# Altium project alpha-board.PrjPCB
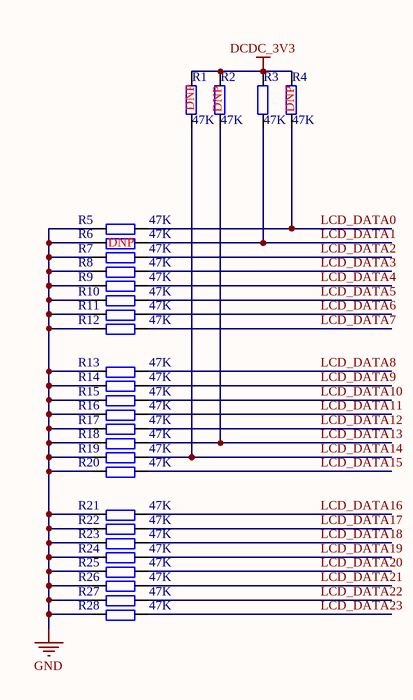
[diagram p0: Sheet1.SchDoc]
8 sheets, 239 parts. Net scope: global (net labels, ports and power ports of the same name join across sheets).
Board file: PCB1.PcbDoc
Sheets:
  Sheet1.SchDoc
  Sheet2.SchDoc
  Sheet3.SchDoc
  Sheet4.SchDoc
  Sheet5.SchDoc
  Sheet6.SchDoc
  Sheet7.SchDoc
  Sheet8.SchDoc

## Sheet Sheet1.SchDoc
size A4

### Parts
R1  47K  [R 0402]
R2  47K  [R 0402]
R3  47K  [R 0402]
R4  47K  [R 0402]
R5  47K  [R 0402]
R6  47K  [R 0402]
R7  47K  [R 0402]
R8  47K  [R 0402]
R9  47K  [R 0402]
R10  47K  [R 0402]
R11  47K  [R 0402]
R12  47K  [R 0402]
R13  47K  [R 0402]
R14  47K  [R 0402]
R15  47K  [R 0402]
R16  47K  [R 0402]
R17  47K  [R 0402]
R18  47K  [R 0402]
R19  47K  [R 0402]
R20  47K  [R 0402]
R21  47K  [R 0402]
R22  47K  [R 0402]
R23  47K  [R 0402]
R24  47K  [R 0402]
R25  47K  [R 0402]
R26  47K  [R 0402]
R27  47K  [R 0402]
R28  47K  [R 0402]

### Nets
DCDC_3V3: R1.1 R2.1 R3.1 R4.1  [project net NVCC_3V3]
GND: R5.1 R6.1 R7.1 R8.1 R9.1 R10.1 R11.1 R12.1 R13.1 R14.1 R15.1 R16.1 R17.1 R18.1 R19.1 R20.1 R21.1 R22.1 R23.1 R24.1 R25.1 R26.1 R27.1 R28.1
LCD_DATA0: R4.2 R5.2
LCD_DATA1: R3.2 R6.2
LCD_DATA2: R7.2
LCD_DATA3: R8.2
LCD_DATA4: R9.2
LCD_DATA5: R10.2
LCD_DATA6: R11.2
LCD_DATA7: R12.2
LCD_DATA8: R13.2
LCD_DATA9: R14.2
LCD_DATA10: R15.2
LCD_DATA11: R16.2
LCD_DATA12: R17.2
LCD_DATA13: R2.2 R18.2
LCD_DATA14: R1.2 R19.2
LCD_DATA15: R20.2
LCD_DATA16: R21.2
LCD_DATA17: R22.2
LCD_DATA18: R23.2
LCD_DATA19: R24.2
LCD_DATA20: R25.2
LCD_DATA21: R26.2
LCD_DATA22: R27.2
LCD_DATA23: R28.2

### Notes on the sheet
- (near R1) DNP
- (near R2) DNP
- (near R4) DNP
- (near R6) DNP

### Library data of the parts
R1-R28 = R

## Sheet Sheet2.SchDoc
size A4
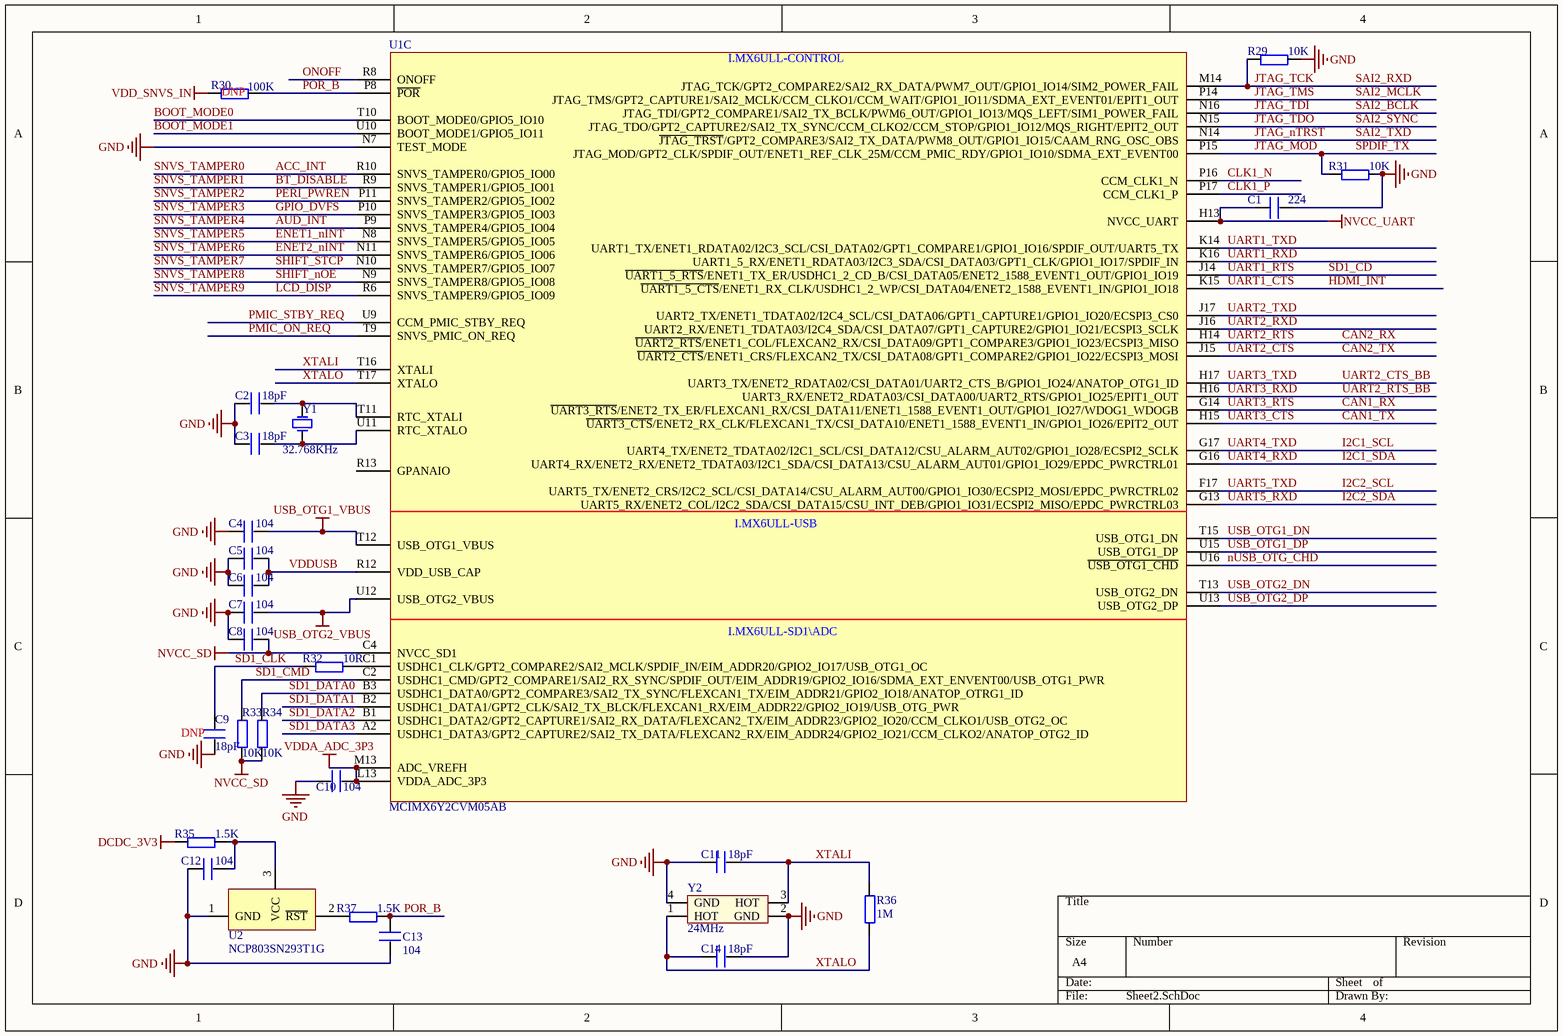
[diagram p1: Sheet2.SchDoc]

### Parts
C1  224  [C 0402]
C2  18pF  [C 0402]
C3  18pF  [C 0402]
C4  104  [C 0402]
C5  104  [C 0402]
C6  104  [C 0402]
C7  104  [C 0402]
C8  104  [C 0402]
C9  18pF  [C 0402]
C10  104  [C 0402]
C11  18pF  [C 0402]
C12  104  [C 0402]
C13  104  [C 0402]
C14  18pF  [C 0402]
R29  10K  [R 0402]
R30  100K  [R 0402]
R31  10K  [R 0402]
R32  10R  [R 0402]
R33  10K  [R 0402]
R34  10K  [R 0402]
R35  1.5K  [R 0402]
R36  1M  [R 0402]
R37  1.5K  [R 0402]
U1  MCIMX6Y2CVM05AB  [BGA289C80P17X17_1400X1400X132]  (part C of 5)
U2  NCP803SN293T1G  [SOT23-3L]
Y1  32.768KHz  [XTAL-3215]
Y2  24MHz  [XTAL-3225]

### Nets
DCDC_3V3: C1.1 C10.2 R35.1 U1.H13(NVCC_UART) U1.L13(VDDA_ADC_3P3) U1.M13(ADC_VREFH)  [also labelled NVCC_UART, VDDA_ADC_3P3]  [project net NVCC_3V3]
GND: C1.2 C2.1 C3.1 C4.1 C5.1 C6.1 C7.1 C8.1 C9.2 C10.1 C11.1 C12.2 C13.1 C14.2 R29.2 R31.2 U1.N7(TEST_MODE) U2.1(GND) Y2.2(GND) Y2.4(GND)
NVCC_SD: C8.2 R33.1 R34.1 U1.C4(NVCC_SD1)
USB_OTG1_VBUS: C4.2 U1.T12(USB_OTG1_VBUS)
USB_OTG2_VBUS: C7.2 U1.U12(USB_OTG2_VBUS)
VDD_SNVS_IN: R30.1
ACC_INT: U1.R10(SNVS_TAMPER0/GPIO5_IO00)  [also labelled SNVS_TAMPER0]
AUD_INT: U1.P9(SNVS_TAMPER4/GPIO5_IO04)  [also labelled SNVS_TAMPER4]
BOOT_MODE0: U1.T10(BOOT_MODE0/GPIO5_IO10)
BOOT_MODE1: U1.U10(BOOT_MODE1/GPIO5_IO11)
BT_DISABLE: U1.R9(SNVS_TAMPER1/GPIO5_IO01)  [also labelled SNVS_TAMPER1]  [project net BEEP]
CAN1_RX: U1.G14(~{UART3_RTS}/ENET2_TX_ER/FLEXCAN1_RX/CSI_DATA11/ENET1_1588_EVENT1_OUT/GPIO1_IO27/WDOG1_WDOGB)  [also labelled UART3_RTS]
CAN1_TX: U1.H15(~{UART3_CTS}/ENET2_RX_CLK/FLEXCAN1_TX/CSI_DATA10/ENET1_1588_EVENT1_IN/GPIO1_IO26/EPIT2_OUT)  [also labelled UART3_CTS]
CAN2_RX: U1.H14(~{UART2_RTS}/ENET1_COL/FLEXCAN2_RX/CSI_DATA09/GPT1_COMPARE3/GPIO1_IO23/ECSPI3_MISO)  [also labelled UART2_RTS]
CAN2_TX: U1.J15(~{UART2_CTS}/ENET1_CRS/FLEXCAN2_TX/CSI_DATA08/GPT1_COMPARE2/GPIO1_IO22/ECSPI3_MOSI)  [also labelled UART2_CTS]
CLK1_N: U1.P16(CCM_CLK1_N)
CLK1_P: U1.P17(CCM_CLK1_P)
ENET1_nINT: U1.N8(SNVS_TAMPER5/GPIO5_IO05)  [also labelled SNVS_TAMPER5]  [project net ENET1_INT_TREE#]
ENET2_nINT: U1.N11(SNVS_TAMPER6/GPIO5_IO06)  [also labelled SNVS_TAMPER6]  [project net ENET2_INT_TREE#]
GPIO_DVFS: U1.P10(SNVS_TAMPER3/GPIO5_IO03)  [also labelled SNVS_TAMPER3]
HDMI_INT: U1.K15(~{UART1_5_CTS}/ENET1_RX_CLK/USDHC1_2_WP/CSI_DATA04/ENET2_1588_EVENT1_IN/GPIO1_IO18)  [also labelled UART1_CTS]
I2C1_SCL: U1.G17(UART4_TX/ENET2_TDATA02/I2C1_SCL/CSI_DATA12/CSU_ALARM_AUT02/GPIO1_IO28/ECSPI2_SCLK)  [also labelled UART4_TXD]
I2C1_SDA: U1.G16(UART4_RX/ENET2_RX/ENET2_TDATA03/I2C1_SDA/CSI_DATA13/CSU_ALARM_AUT01/GPIO1_IO29/EPDC_PWRCTRL01)  [also labelled UART4_RXD]
I2C2_SCL: U1.F17(UART5_TX/ENET2_CRS/I2C2_SCL/CSI_DATA14/CSU_ALARM_AUT00/GPIO1_IO30/ECSPI2_MOSI/EPDC_PWRCTRL02)  [also labelled UART5_TXD]
I2C2_SDA: U1.G13(UART5_RX/ENET2_COL/I2C2_SDA/CSI_DATA15/CSU_INT_DEB/GPIO1_IO31/ECSPI2_MISO/EPDC_PWRCTRL03)  [also labelled UART5_RXD]
JTAG_MOD: R31.1 U1.P15(JTAG_MOD/GPT2_CLK/SPDIF_OUT/ENET1_REF_CLK_25M/CCM_PMIC_RDY/GPIO1_IO10/SDMA_EXT_EVENT00)  [also labelled SPDIF_TX]  [project net 6D_INT]
JTAG_nTRST: U1.N14(~{JTAG_TRST}/GPT2_COMPARE3/SAI2_TX_DATA/PWM8_OUT/GPIO1_IO15/CAAM_RNG_OSC_OBS)  [also labelled SAI2_TXD]
JTAG_TCK: R29.1 U1.M14(JTAG_TCK/GPT2_COMPARE2/SAI2_RX_DATA/PWM7_OUT/GPIO1_IO14/SIM2_POWER_FAIL)  [also labelled SAI2_RXD]
JTAG_TDI: U1.N16(JTAG_TDI/GPT2_COMPARE1/SAI2_TX_BCLK/PWM6_OUT/GPIO1_IO13/MQS_LEFT/SIM1_POWER_FAIL)  [also labelled SAI2_BCLK]
JTAG_TDO: U1.N15(JTAG_TDO/GPT2_CAPTURE2/SAI2_TX_SYNC/CCM_CLKO2/CCM_STOP/GPIO1_IO12/MQS_RIGHT/EPIT2_OUT)  [also labelled SAI2_SYNC]
JTAG_TMS: U1.P14(JTAG_TMS/GPT2_CAPTURE1/SAI2_MCLK/CCM_CLKO1/CCM_WAIT/GPIO1_IO11/SDMA_EXT_EVENT01/EPIT1_OUT)  [also labelled SAI2_MCLK]
LCD_DISP: U1.R6(SNVS_TAMPER9/GPIO5_IO09)  [also labelled SNVS_TAMPER9]  [project net CT_RST]
nUSB_OTG_CHD: U1.U16(~{USB_OTG1_CHD})
ONOFF: U1.R8(ONOFF)
PERI_PWREN: U1.P11(SNVS_TAMPER2/GPIO5_IO02)  [also labelled SNVS_TAMPER2]
PMIC_ON_REQ: U1.T9(SNVS_PMIC_ON_REQ)
PMIC_STBY_REQ: U1.U9(CCM_PMIC_STBY_REQ)
POR_B: C13.2 R30.2 R37.2 U1.P8(~{POR})
SD1_CD: U1.J14(~{UART1_5_}~{RTS}/ENET1_TX_ER/USDHC1_2_CD_B/CSI_DATA05/ENET2_1588_EVENT1_OUT/GPIO1_IO19)  [also labelled UART1_RTS]
SD1_CLK: C9.1 R32.1
SD1_CMD: R33.2 U1.C2(USDHC1_CMD/GPT2_COMPARE1/SAI2_RX_SYNC/SPDIF_OUT/EIM_ADDR19/GPIO2_IO16/SDMA_EXT_ENVENT00/USB_OTG1_PWR)
SD1_DATA0: R34.2 U1.B3(USDHC1_DATA0/GPT2_COMPARE3/SAI2_TX_SYNC/FLEXCAN1_TX/EIM_ADDR21/GPIO2_IO18/ANATOP_OTRG1_ID)
SD1_DATA1: U1.B2(USDHC1_DATA1/GPT2_CLK/SAI2_TX_BLCK/FLEXCAN1_RX/EIM_ADDR22/GPIO2_IO19/USB_OTG_PWR)
SD1_DATA2: U1.B1(USDHC1_DATA2/GPT2_CAPTURE1/SAI2_RX_DATA/FLEXCAN2_TX/EIM_ADDR23/GPIO2_IO20/CCM_CLKO1/USB_OTG2_OC)
SD1_DATA3: U1.A2(USDHC1_DATA3/GPT2_CAPTURE2/SAI2_TX_DATA/FLEXCAN2_RX/EIM_ADDR24/GPIO2_IO21/CCM_CLKO2/ANATOP_OTG2_ID)
SHIFT_nOE: U1.N9(SNVS_TAMPER8/GPIO5_IO08)  [also labelled SNVS_TAMPER8]  [project net ENET2_RST]
SHIFT_STCP: U1.N10(SNVS_TAMPER7/GPIO5_IO07)  [also labelled SNVS_TAMPER7]  [project net ENET1_RST]
UART1_RXD: U1.K16(UART1_5_RX/ENET1_RDATA03/I2C3_SDA/CSI_DATA03/GPT1_CLK/GPIO1_IO17/SPDIF_IN)
UART1_TXD: U1.K14(UART1_TX/ENET1_RDATA02/I2C3_SCL/CSI_DATA02/GPT1_COMPARE1/GPIO1_IO16/SPDIF_OUT/UART5_TX)
UART2_CTS_BB: U1.H17(UART3_TX/ENET2_RDATA02/CSI_DATA01/UART2_CTS_B/GPIO1_IO24/ANATOP_OTG1_ID)  [also labelled UART3_TXD]
UART2_RTS_BB: U1.H16(UART3_RX/ENET2_RDATA03/CSI_DATA00/UART2_RTS/GPIO1_IO25/EPIT1_OUT)  [also labelled UART3_RXD]
UART2_RXD: U1.J16(UART2_RX/ENET1_TDATA03/I2C4_SDA/CSI_DATA07/GPT1_CAPTURE2/GPIO1_IO21/ECSPI3_SCLK)  [project net ECSPI3_SCLK]
UART2_TXD: U1.J17(UART2_TX/ENET1_TDATA02/I2C4_SCL/CSI_DATA06/GPT1_CAPTURE1/GPIO1_IO20/ECSPI3_CS0)  [project net ECSPI3_SS0]
USB_OTG1_DN: U1.T15(USB_OTG1_DN)
USB_OTG1_DP: U1.U15(USB_OTG1_DP)
USB_OTG2_DN: U1.T13(USB_OTG2_DN)
USB_OTG2_DP: U1.U13(USB_OTG2_DP)
VDDUSB: C5.2 C6.2 U1.R12(VDD_USB_CAP)
XTALI: C11.2 R36.2 U1.T16(XTALI) Y2.3(HOT)
XTALO: C14.1 R36.1 U1.T17(XTALO) Y2.1(HOT)
NetC2_2: C2.2 U1.T11(RTC_XTALI) Y1.2(OSC2)
NetC3_2: C3.2 U1.U11(RTC_XTALO) Y1.1(OSC1)
NetC12_1: C12.1 R35.2 U2.3(VCC)
NetR32_2: R32.2 U1.C1(USDHC1_CLK/GPT2_COMPARE2/SAI2_MCLK/SPDIF_IN/EIM_ADDR20/GPIO2_IO17/USB_OTG1_OC)
NetR37_1: R37.1 U2.2(~{RST})

Not connected (* = marked no-connect by the designer): U1 R13(GPANAIO)

### Notes on the sheet
- (near R30) DNP
- (near C9) DNP
- (in symbol MCIMX6Y2CVM05AB, part C) I.MX6ULL-CONTROL; I.MX6ULL-USB; I.MX6ULL-SD1\ADC

### Library data of the parts
C1-C14 = C
R29-R37 = R
Y1 = XTAL: 普通晶振; Published: 8-Jun-2000; LatestRevisionDate: 17-Jul-2002; LatestRevisionNote: Re-released for DXP Platform.; Publisher: Altium Limited
Y2 = XTAL_3225: 3225贴片无源晶振

## Sheet Sheet3.SchDoc
size A4
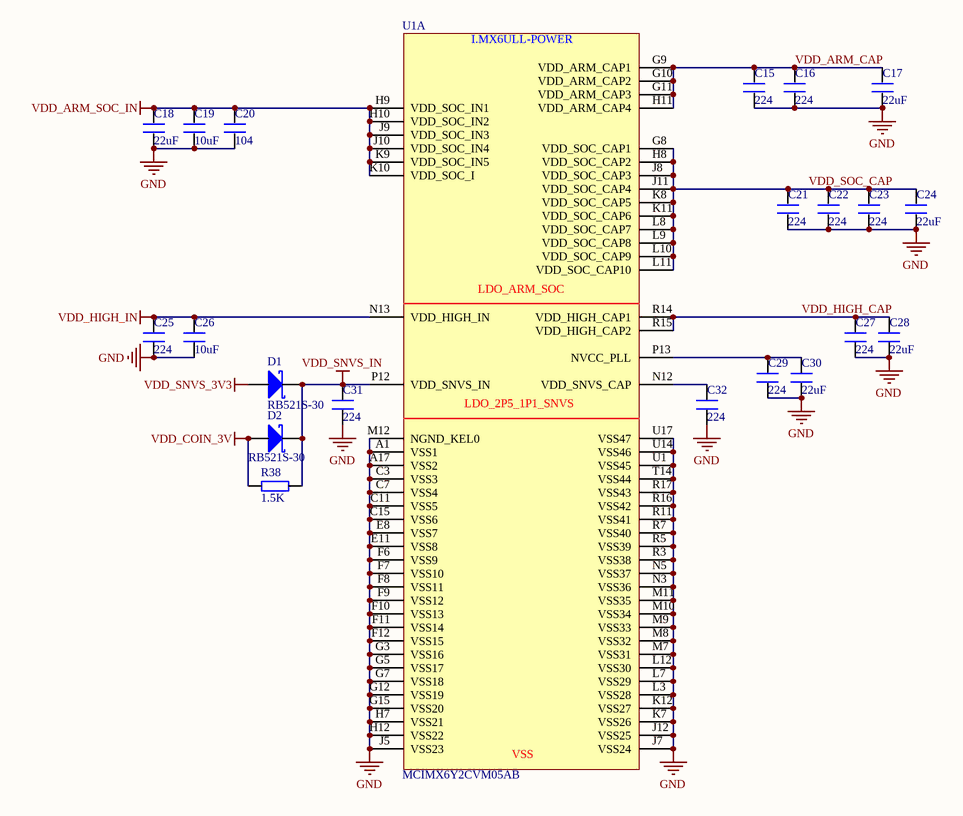
[diagram p2: Sheet3.SchDoc]

### Parts
C15  224  [C 0402]
C16  224  [C 0402]
C17  22uF  [C 0402]
C18  22uF  [C 0402]
C19  10uF  [C 0402]
C20  104  [C 0402]
C21  224  [C 0402]
C22  224  [C 0402]
C23  224  [C 0402]
C24  22uF  [C 0402]
C25  224  [C 0402]
C26  10uF  [C 0402]
C27  224  [C 0402]
C28  22uF  [C 0402]
C29  224  [C 0402]
C30  22uF  [C 0402]
C31  224  [C 0402]
C32  224  [C 0402]
D1  RB521S-30  [SOD-523]
D2  RB521S-30  [SOD-523]
R38  1.5K  [R 0402]
U1  MCIMX6Y2CVM05AB  [BGA289C80P17X17_1400X1400X132]  (part A of 5)

### Nets
GND: C15.1 C16.1 C17.1 C18.1 C19.1 C20.1 C21.1 C22.1 C23.1 C24.1 C25.1 C26.1 C27.1 C28.1 C29.1 C30.1 C31.1 C32.1 U1.A1(VSS1) U1.A17(VSS2) U1.C3(VSS3) U1.C7(VSS4) U1.C11(VSS5) U1.C15(VSS6) U1.E8(VSS7) U1.E11(VSS8) U1.F6(VSS9) U1.F7(VSS10) U1.F8(VSS11) U1.F9(VSS12) U1.F10(VSS13) U1.F11(VSS14) U1.F12(VSS15) U1.G3(VSS16) U1.G5(VSS17) U1.G7(VSS18) U1.G12(VSS19) U1.G15(VSS20) U1.H7(VSS21) U1.H12(VSS22) U1.J5(VSS23) U1.J7(VSS24) U1.J12(VSS25) U1.K7(VSS26) U1.K12(VSS27) U1.L3(VSS28) U1.L7(VSS29) U1.L12(VSS30) U1.M7(VSS31) U1.M8(VSS32) U1.M9(VSS33) U1.M10(VSS34) U1.M11(VSS35) U1.M12(NGND_KEL0) U1.N3(VSS36) U1.N5(VSS37) U1.R3(VSS38) U1.R5(VSS39) U1.R7(VSS40) U1.R11(VSS41) U1.R16(VSS42) U1.R17(VSS43) U1.T14(VSS44) U1.U1(VSS45) U1.U14(VSS46) U1.U17(VSS47)
VDD_ARM_SOC_IN: C18.2 C19.2 C20.2 U1.H9(VDD_SOC_IN1) U1.H10(VDD_SOC_IN2) U1.J9(VDD_SOC_IN3) U1.J10(VDD_SOC_IN4) U1.K9(VDD_SOC_IN5) U1.K10(VDD_SOC_I)
VDD_COIN_3V: D2.1(A) R38.1
VDD_HIGH_IN: C25.2 C26.2 U1.N13(VDD_HIGH_IN)
VDD_SNVS_3V3: D1.1(A)
VDD_SNVS_IN: C31.2 D1.2(C) D2.2(C) R38.2 U1.P12(VDD_SNVS_IN)
VDD_ARM_CAP: C15.2 C16.2 C17.2 U1.G9(VDD_ARM_CAP1) U1.G10(VDD_ARM_CAP2) U1.G11(VDD_ARM_CAP3) U1.H11(VDD_ARM_CAP4)
VDD_HIGH_CAP: C27.2 C28.2 U1.R14(VDD_HIGH_CAP1) U1.R15(VDD_HIGH_CAP2)
VDD_SOC_CAP: C21.2 C22.2 C23.2 C24.2 U1.G8(VDD_SOC_CAP1) U1.H8(VDD_SOC_CAP2) U1.J8(VDD_SOC_CAP3) U1.J11(VDD_SOC_CAP4) U1.K8(VDD_SOC_CAP5) U1.K11(VDD_SOC_CAP6) U1.L8(VDD_SOC_CAP7) U1.L9(VDD_SOC_CAP8) U1.L10(VDD_SOC_CAP9) U1.L11(VDD_SOC_CAP10)
NetC29_2: C29.2 C30.2 U1.P13(NVCC_PLL)
NetC32_2: C32.2 U1.N12(VDD_SNVS_CAP)

### Notes on the sheet
- (in symbol MCIMX6Y2CVM05AB, part A) I.MX6ULL-POWER; LDO_ARM_SOC; LDO_2P5_1P1_SNVS; VSS

### Library data of the parts
C15-C32 = C
R38 = R

## Sheet Sheet4.SchDoc
size A4
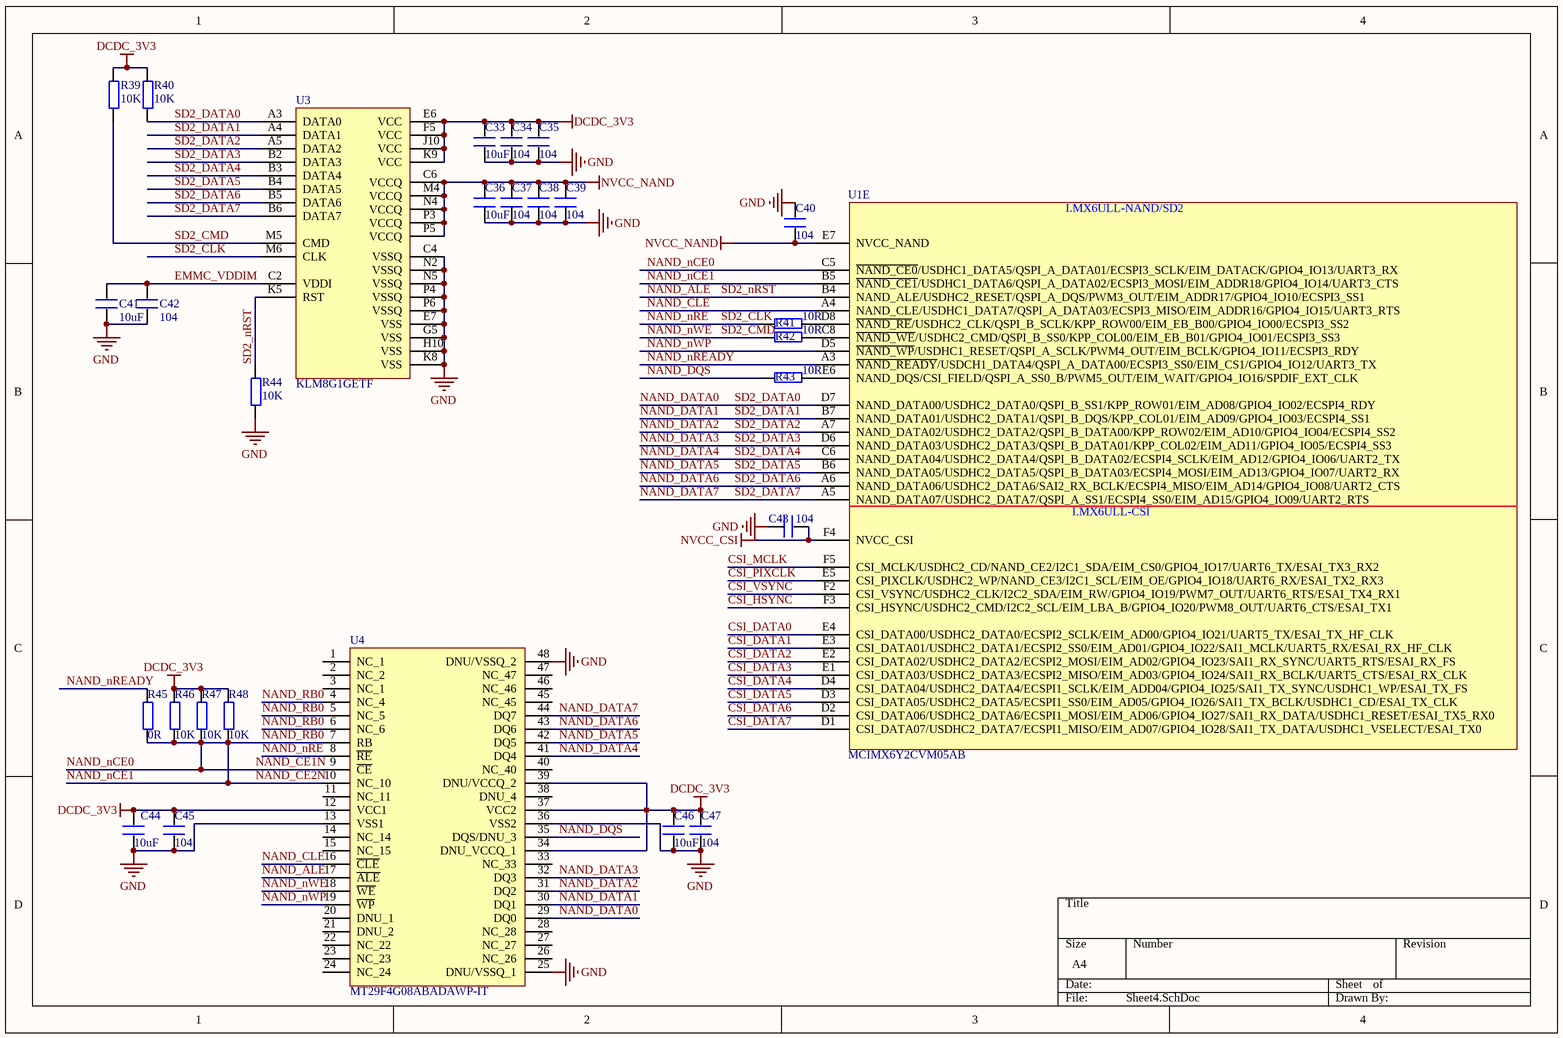
[diagram p3: Sheet4.SchDoc]

### Parts
C33  10uF  [C 0402]
C34  104  [C 0402]
C35  104  [C 0402]
C36  10uF  [C 0402]
C37  104  [C 0402]
C38  104  [C 0402]
C39  104  [C 0402]
C40  104  [C 0402]
C41  10uF  [C 0402]
C42  104  [C 0402]
C43  104  [C 0402]
C44  10uF  [C 0402]
C45  104  [C 0402]
C46  10uF  [C 0402]
C47  104  [C 0402]
R39  10K  [R 0402]
R40  10K  [R 0402]
R41  10R  [R 0402]
R42  10R  [R 0402]
R43  10R  [R 0402]
R44  10K  [R 0402]
R45  0R  [R 0402]
R46  10K  [R 0402]
R47  10K  [R 0402]
R48  10K  [R 0402]
U1  MCIMX6Y2CVM05AB  [BGA289C80P17X17_1400X1400X132]  (part E of 5)
U3  KLM8G1GETF  [BGA169  EMMC]
U4  MT29F4G08ABADAWP-IT  [TSOP48]

### Nets
DCDC_3V3: C33.2 C34.2 C35.2 C36.2 C37.2 C38.2 C39.2 C40.1 C44.2 C45.2 C46.2 C47.2 R39.2 R40.2 R46.2 R47.2 R48.2 U1.E7(NVCC_NAND) U3.C6(VCCQ) U3.E6(VCC) U3.F5(VCC) U3.J10(VCC) U3.K9(VCC) U3.M4(VCCQ) U3.N4(VCCQ) U3.P3(VCCQ) U3.P5(VCCQ) U4.12(VCC1) U4.34(DNU_VCCQ_1) U4.37(VCC2) U4.39(DNU/VCCQ_2)  [also labelled NVCC_NAND]  [project net NVCC_3V3]
GND: C33.1 C34.1 C35.1 C36.1 C37.1 C38.1 C39.1 C40.2 C41.1 C42.1 C43.2 C44.1 C45.1 C46.1 C47.1 R44.1 U3.C4(VSSQ) U3.E7(VSS) U3.G5(VSS) U3.H10(VSS) U3.K8(VSS) U3.N2(VSSQ) U3.N5(VSSQ) U3.P4(VSSQ) U3.P6(VSSQ) U4.13(VSS1) U4.25(DNU/VSSQ_1) U4.36(VSS2) U4.48(DNU/VSSQ_2)
NVCC_CSI: C43.1 U1.F4(NVCC_CSI)
CSI_DATA0: U1.E4(CSI_DATA00/USDHC2_DATA0/ECSPI2_SCLK/EIM_AD00/GPIO4_IO21/UART5_TX/ESAI_TX_HF_CLK)
CSI_DATA1: U1.E3(CSI_DATA01/USDHC2_DATA1/ECSPI2_SS0/EIM_AD01/GPIO4_IO22/SAI1_MCLK/UART5_RX/ESAI_RX_HF_CLK)
CSI_DATA2: U1.E2(CSI_DATA02/USDHC2_DATA2/ECSPI2_MOSI/EIM_AD02/GPIO4_IO23/SAI1_RX_SYNC/UART5_RTS/ESAI_RX_FS)
CSI_DATA3: U1.E1(CSI_DATA03/USDHC2_DATA3/ECSPI2_MISO/EIM_AD03/GPIO4_IO24/SAI1_RX_BCLK/UART5_CTS/ESAI_RX_CLK)
CSI_DATA4: U1.D4(CSI_DATA04/USDHC2_DATA4/ECSPI1_SCLK/EIM_ADD04/GPIO4_IO25/SAI1_TX_SYNC/USDHC1_WP/ESAI_TX_FS)
CSI_DATA5: U1.D3(CSI_DATA05/USDHC2_DATA5/ECSPI1_SS0/EIM_AD05/GPIO4_IO26/SAI1_TX_BCLK/USDHC1_CD/ESAI_TX_CLK)
CSI_DATA6: U1.D2(CSI_DATA06/USDHC2_DATA6/ECSPI1_MOSI/EIM_AD06/GPIO4_IO27/SAI1_RX_DATA/USDHC1_RESET/ESAI_TX5_RX0)
CSI_DATA7: U1.D1(CSI_DATA07/USDHC2_DATA7/ECSPI1_MISO/EIM_AD07/GPIO4_IO28/SAI1_TX_DATA/USDHC1_VSELECT/ESAI_TX0)
CSI_HSYNC: U1.F3(CSI_HSYNC/USDHC2_CMD/I2C2_SCL/EIM_LBA_B/GPIO4_IO20/PWM8_OUT/UART6_CTS/ESAI_TX1)
CSI_MCLK: U1.F5(CSI_MCLK/USDHC2_CD/NAND_CE2/I2C1_SDA/EIM_CS0/GPIO4_IO17/UART6_TX/ESAI_TX3_RX2)
CSI_PIXCLK: U1.E5(CSI_PIXCLK/USDHC2_WP/NAND_CE3/I2C1_SCL/EIM_OE/GPIO4_IO18/UART6_RX/ESAI_TX2_RX3)
CSI_VSYNC: U1.F2(CSI_VSYNC/USDHC2_CLK/I2C2_SDA/EIM_RW/GPIO4_IO19/PWM7_OUT/UART6_RTS/ESAI_TX4_RX1)
EMMC_VDDIM: C41.2 C42.2 U3.C2(VDDI)
NAND_ALE: R44.2 U1.B4(NAND_ALE/USDHC2_RESET/QSPI_A_DQS/PWM3_OUT/EIM_ADDR17/GPIO4_IO10/ECSPI3_SS1) U3.K5(RST) U4.17(~{ALE})  [also labelled SD2_nRST]
NAND_CE1N: R45.1 R46.1 R47.1 R48.1 U1.B5(~{NAND_CE1}/USDHC1_DATA6/QSPI_A_DATA02/ECSPI3_MOSI/EIM_ADDR18/GPIO4_IO14/UART3_CTS) U1.C5(~{NAND_CE0}/USDHC1_DATA5/QSPI_A_DATA01/ECSPI3_SCLK/EIM_DATACK/GPIO4_IO13/UART3_RX) U4.4(NC_4) U4.5(NC_5) U4.6(NC_6) U4.7(RB) U4.9(~{CE}) U4.10(NC_10)  [also labelled NAND_CE2N, NAND_nCE0, NAND_nCE1, NAND_RB0]
NAND_CLE: U1.A4(NAND_CLE/USDHC1_DATA7/QSPI_A_DATA03/ECSPI3_MISO/EIM_ADDR16/GPIO4_IO15/UART3_RTS) U4.16(~{CLE})
NAND_DATA0: R40.1 U1.D7(NAND_DATA00/USDHC2_DATA0/QSPI_B_SS1/KPP_ROW01/EIM_AD08/GPIO4_IO02/ECSPI4_RDY) U3.A3(DATA0) U4.29(DQ0)  [also labelled SD2_DATA0]
NAND_DATA1: U1.B7(NAND_DATA01/USDHC2_DATA1/QSPI_B_DQS/KPP_COL01/EIM_AD09/GPIO4_IO03/ECSPI4_SS1) U3.A4(DATA1) U4.30(DQ1)  [also labelled SD2_DATA1]
NAND_DATA2: U1.A7(NAND_DATA02/USDHC2_DATA2/QSPI_B_DATA00/KPP_ROW02/EIM_AD10/GPIO4_IO04/ECSPI4_SS2) U3.A5(DATA2) U4.31(DQ2)  [also labelled SD2_DATA2]
NAND_DATA3: U1.D6(NAND_DATA03/USDHC2_DATA3/QSPI_B_DATA01/KPP_COL02/EIM_AD11/GPIO4_IO05/ECSPI4_SS3) U3.B2(DATA3) U4.32(DQ3)  [also labelled SD2_DATA3]
NAND_DATA4: U1.C6(NAND_DATA04/USDHC2_DATA4/QSPI_B_DATA02/ECSPI4_SCLK/EIM_AD12/GPIO4_IO06/UART2_TX) U3.B3(DATA4) U4.41(DQ4)  [also labelled SD2_DATA4]
NAND_DATA5: U1.B6(NAND_DATA05/USDHC2_DATA5/QSPI_B_DATA03/ECSPI4_MOSI/EIM_AD13/GPIO4_IO07/UART2_RX) U3.B4(DATA5) U4.42(DQ5)  [also labelled SD2_DATA5]
NAND_DATA6: U1.A6(NAND_DATA06/USDHC2_DATA6/SAI2_RX_BCLK/ECSPI4_MISO/EIM_AD14/GPIO4_IO08/UART2_CTS) U3.B5(DATA6) U4.43(DQ6)  [also labelled SD2_DATA6]
NAND_DATA7: U1.A5(NAND_DATA07/USDHC2_DATA7/QSPI_A_SS1/ECSPI4_SS0/EIM_AD15/GPIO4_IO09/UART2_RTS) U3.B6(DATA7) U4.44(DQ7)  [also labelled SD2_DATA7]
NAND_DQS: R43.2 U4.35(DQS/DNU_3)
NAND_nRE: R41.2 U3.M6(CLK) U4.8(~{RE})  [also labelled SD2_CLK]
NAND_nREADY: R45.2 U1.A3(~{NAND_READY}/USDCH1_DATA4/QSPI_A_DATA00/ECSPI3_SS0/EIM_CS1/GPIO4_IO12/UART3_TX)
NAND_nWE: R39.1 R42.2 U3.M5(CMD) U4.18(~{WE})  [also labelled SD2_CMD]
NAND_nWP: U1.D5(~{NAND_WP}/USDHC1_RESET/QSPI_A_SCLK/PWM4_OUT/EIM_BCLK/GPIO4_IO11/ECSPI3_RDY) U4.19(~{WP})
NetR41_1: R41.1 U1.D8(~{NAND_RE}/USDHC2_CLK/QSPI_B_SCLK/KPP_ROW00/EIM_EB_B00/GPIO4_IO00/ECSPI3_SS2)
NetR42_1: R42.1 U1.C8(~{NAND_WE}/USDHC2_CMD/QSPI_B_SS0/KPP_COL00/EIM_EB_B01/GPIO4_IO01/ECSPI3_SS3)
NetR43_1: R43.1 U1.E6(NAND_DQS/CSI_FIELD/QSPI_A_SS0_B/PWM5_OUT/EIM_WAIT/GPIO4_IO16/SPDIF_EXT_CLK)

Not connected (* = marked no-connect by the designer): U4 1(NC_1) 2(NC_2) 3(NC_1) 11(NC_11) 14(NC_14) 15(NC_15) 20(DNU_1) 21(DNU_2) 22(NC_22) 23(NC_23) 24(NC_24) 26(NC_26) 27(NC_27) 28(NC_28) 33(NC_33) 38(DNU_4) 40(NC_40) 45(NC_45) 46(NC_46) 47(NC_47)

### Notes on the sheet
- (in symbol MCIMX6Y2CVM05AB, part E) I.MX6ULL-NAND/SD2; I.MX6ULL-CSI

### Library data of the parts
C33-C47 = C
R39-R48 = R
U3 = THGBM4G5D1HBAIR/4GB
U4 = MT29F16G16G08CBACA

## Sheet Sheet5.SchDoc
size A4
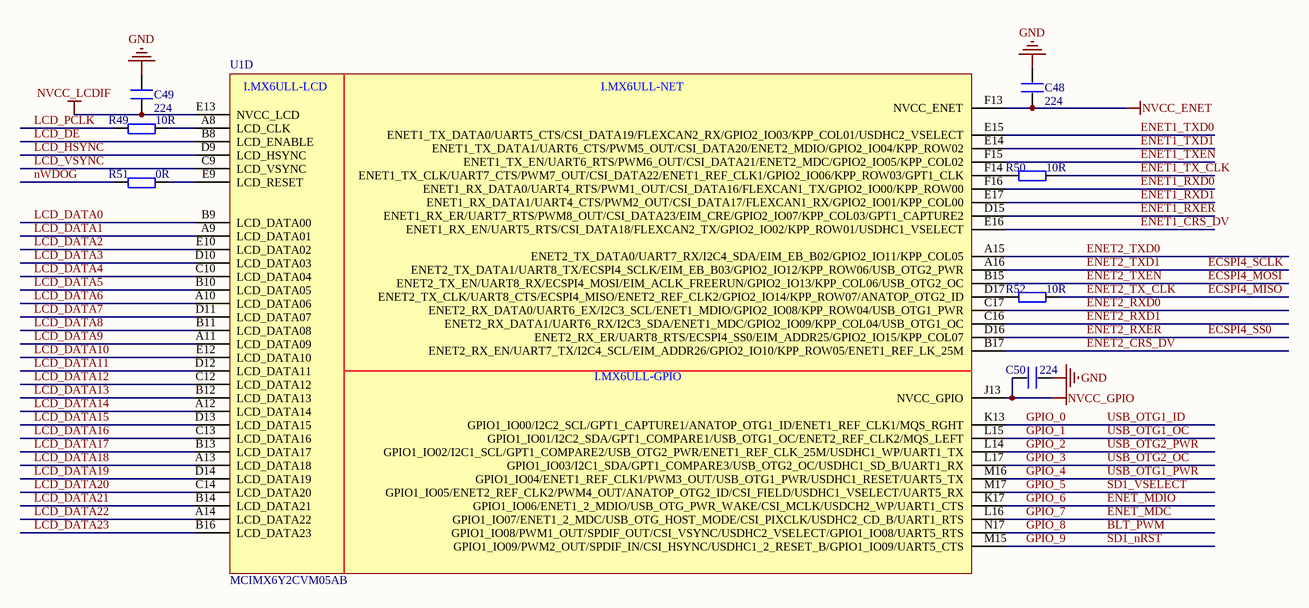
[diagram p4: Sheet5.SchDoc]

### Parts
C48  224  [C 0402]
C49  224  [C 0402]
C50  224  [C 0402]
R49  10R  [R 0402]
R50  10R  [R 0402]
R51  0R  [R 0402]
R52  10R  [R 0402]
U1  MCIMX6Y2CVM05AB  [BGA289C80P17X17_1400X1400X132]  (part D of 5)

### Nets
GND: C48.2 C49.2 C50.1
NVCC_ENET: C48.1 C49.1 C50.2 U1.E13(NVCC_LCD) U1.F13(NVCC_ENET) U1.J13(NVCC_GPIO)  [also labelled NVCC_GPIO, NVCC_LCDIF]  [project net NVCC_3V3]
BLT_PWM: U1.N17(GPIO1_IO08/PWM1_OUT/SPDIF_OUT/CSI_VSYNC/USDHC2_VSELECT/GPIO1_IO08/UART5_RTS)  [also labelled GPIO_8]
ECSPI4_MISO: R52.2  [also labelled ENET2_TX_CLK]
ECSPI4_MOSI: U1.B15(ENET2_TX_EN/UART8_RX/ECSPI4_MOSI/EIM_ACLK_FREERUN/GPIO2_IO13/KPP_COL06/USB_OTG2_OC)  [also labelled ENET2_TXEN]
ECSPI4_SCLK: U1.A16(ENET2_TX_DATA1/UART8_TX/ECSPI4_SCLK/EIM_EB_B03/GPIO2_IO12/KPP_ROW06/USB_OTG2_PWR)  [also labelled ENET2_TXD1]
ECSPI4_SS0: U1.D16(ENET2_RX_ER/UART8_RTS/ECSPI4_SS0/EIM_ADDR25/GPIO2_IO15/KPP_COL07)  [also labelled ENET2_RXER]
ENET1_CRS_DV: U1.E16(ENET1_RX_EN/UART5_RTS/CSI_DATA18/FLEXCAN2_TX/GPIO2_IO02/KPP_ROW01/USDHC1_VSELECT)
ENET1_RXD0: U1.F16(ENET1_RX_DATA0/UART4_RTS/PWM1_OUT/CSI_DATA16/FLEXCAN1_TX/GPIO2_IO00/KPP_ROW00)
ENET1_RXD1: U1.E17(ENET1_RX_DATA1/UART4_CTS/PWM2_OUT/CSI_DATA17/FLEXCAN1_RX/GPIO2_IO01/KPP_COL00)
ENET1_RXER: U1.D15(ENET1_RX_ER/UART7_RTS/PWM8_OUT/CSI_DATA23/EIM_CRE/GPIO2_IO07/KPP_COL03/GPT1_CAPTURE2)
ENET1_TX_CLK: R50.2
ENET1_TXD0: U1.E15(ENET1_TX_DATA0/UART5_CTS/CSI_DATA19/FLEXCAN2_RX/GPIO2_IO03/KPP_COL01/USDHC2_VSELECT)
ENET1_TXD1: U1.E14(ENET1_TX_DATA1/UART6_CTS/PWM5_OUT/CSI_DATA20/ENET2_MDIO/GPIO2_IO04/KPP_ROW02)
ENET1_TXEN: U1.F15(ENET1_TX_EN/UART6_RTS/PWM6_OUT/CSI_DATA21/ENET2_MDC/GPIO2_IO05/KPP_COL02)
ENET2_CRS_DV: U1.B17(ENET2_RX_EN/UART7_TX/I2C4_SCL/EIM_ADDR26/GPIO2_IO10/KPP_ROW05/ENET1_REF_LK_25M)
ENET2_RXD0: U1.C17(ENET2_RX_DATA0/UART6_EX/I2C3_SCL/ENET1_MDIO/GPIO2_IO08/KPP_ROW04/USB_OTG1_PWR)
ENET2_RXD1: U1.C16(ENET2_RX_DATA1/UART6_RX/I2C3_SDA/ENET1_MDC/GPIO2_IO09/KPP_COL04/USB_OTG1_OC)
ENET2_TXD0: U1.A15(ENET2_TX_DATA0/UART7_RX/I2C4_SDA/EIM_EB_B02/GPIO2_IO11/KPP_COL05)
ENET_MDC: U1.L16(GPIO1_IO07/ENET1_2_MDC/USB_OTG_HOST_MODE/CSI_PIXCLK/USDHC2_CD_B/UART1_RTS)  [also labelled GPIO_7]
ENET_MDIO: U1.K17(GPIO1_IO06/ENET1_2_MDIO/USB_OTG_PWR_WAKE/CSI_MCLK/USDCH2_WP/UART1_CTS)  [also labelled GPIO_6]
GPIO_0: U1.K13(GPIO1_IO00/I2C2_SCL/GPT1_CAPTURE1/ANATOP_OTG1_ID/ENET1_REF_CLK1/MQS_RGHT)  [also labelled USB_OTG1_ID]
GPIO_1: U1.L15(GPIO1_IO01/I2C2_SDA/GPT1_COMPARE1/USB_OTG1_OC/ENET2_REF_CLK2/MQS_LEFT)  [also labelled USB_OTG1_OC]  [project net AP_INT]
GPIO_2: U1.L14(GPIO1_IO02/I2C1_SCL/GPT1_COMPARE2/USB_OTG2_PWR/ENET1_REF_CLK_25M/USDHC1_WP/UART1_TX)  [also labelled USB_OTG2_PWR]  [project net CSI_RESET]
GPIO_3: U1.L17(GPIO1_IO03/I2C1_SDA/GPT1_COMPARE3/USB_OTG2_OC/USDHC1_SD_B/UART1_RX)  [also labelled USB_OTG2_OC]
GPIO_4: U1.M16(GPIO1_IO04/ENET1_REF_CLK1/PWM3_OUT/USB_OTG1_PWR/USDHC1_RESET/UART5_TX)  [also labelled USB_OTG1_PWR]  [project net CSI_PWDN]
GPIO_5: U1.M17(GPIO1_IO05/ENET2_REF_CLK2/PWM4_OUT/ANATOP_OTG2_ID/CSI_FIELD/USDHC1_VSELECT/UART5_RX)  [also labelled SD1_VSELECT]
GPIO_9: U1.M15(GPIO1_IO09/PWM2_OUT/SPDIF_IN/CSI_HSYNC/USDHC1_2_RESET_B/GPIO1_IO09/UART5_CTS)  [also labelled SD1_nRST]  [project net CT_INT]
LCD_DATA0: U1.B9(LCD_DATA00)
LCD_DATA1: U1.A9(LCD_DATA01)
LCD_DATA2: U1.E10(LCD_DATA02)
LCD_DATA3: U1.D10(LCD_DATA03)
LCD_DATA4: U1.C10(LCD_DATA04)
LCD_DATA5: U1.B10(LCD_DATA05)
LCD_DATA6: U1.A10(LCD_DATA06)
LCD_DATA7: U1.D11(LCD_DATA07)
LCD_DATA8: U1.B11(LCD_DATA08)
LCD_DATA9: U1.A11(LCD_DATA09)
LCD_DATA10: U1.E12(LCD_DATA10)
LCD_DATA11: U1.D12(LCD_DATA11)
LCD_DATA12: U1.C12(LCD_DATA12)
LCD_DATA13: U1.B12(LCD_DATA13)
LCD_DATA14: U1.A12(LCD_DATA14)
LCD_DATA15: U1.D13(LCD_DATA15)
LCD_DATA16: U1.C13(LCD_DATA16)
LCD_DATA17: U1.B13(LCD_DATA17)
LCD_DATA18: U1.A13(LCD_DATA18)
LCD_DATA19: U1.D14(LCD_DATA19)
LCD_DATA20: U1.C14(LCD_DATA20)
LCD_DATA21: U1.B14(LCD_DATA21)
LCD_DATA22: U1.A14(LCD_DATA22)
LCD_DATA23: U1.B16(LCD_DATA23)
LCD_DE: U1.B8(LCD_ENABLE)
LCD_HSYNC: U1.D9(LCD_HSYNC)
LCD_PCLK: R49.1
LCD_VSYNC: U1.C9(LCD_VSYNC)
nWDOG: R51.1
NetR49_2: R49.2 U1.A8(LCD_CLK)
NetR50_1: R50.1 U1.F14(ENET1_TX_CLK/UART7_CTS/PWM7_OUT/CSI_DATA22/ENET1_REF_CLK1/GPIO2_IO06/KPP_ROW03/GPT1_CLK)
NetR51_2: R51.2 U1.E9(LCD_RESET)
NetR52_1: R52.1 U1.D17(ENET2_TX_CLK/UART8_CTS/ECSPI4_MISO/ENET2_REF_CLK2/GPIO2_IO14/KPP_ROW07/ANATOP_OTG2_ID)

### Notes on the sheet
- (in symbol MCIMX6Y2CVM05AB, part D) I.MX6ULL-LCD; I.MX6ULL-NET; I.MX6ULL-GPIO

### Library data of the parts
C48-C50 = C
R49-R52 = R

## Sheet Sheet6.SchDoc
size A4
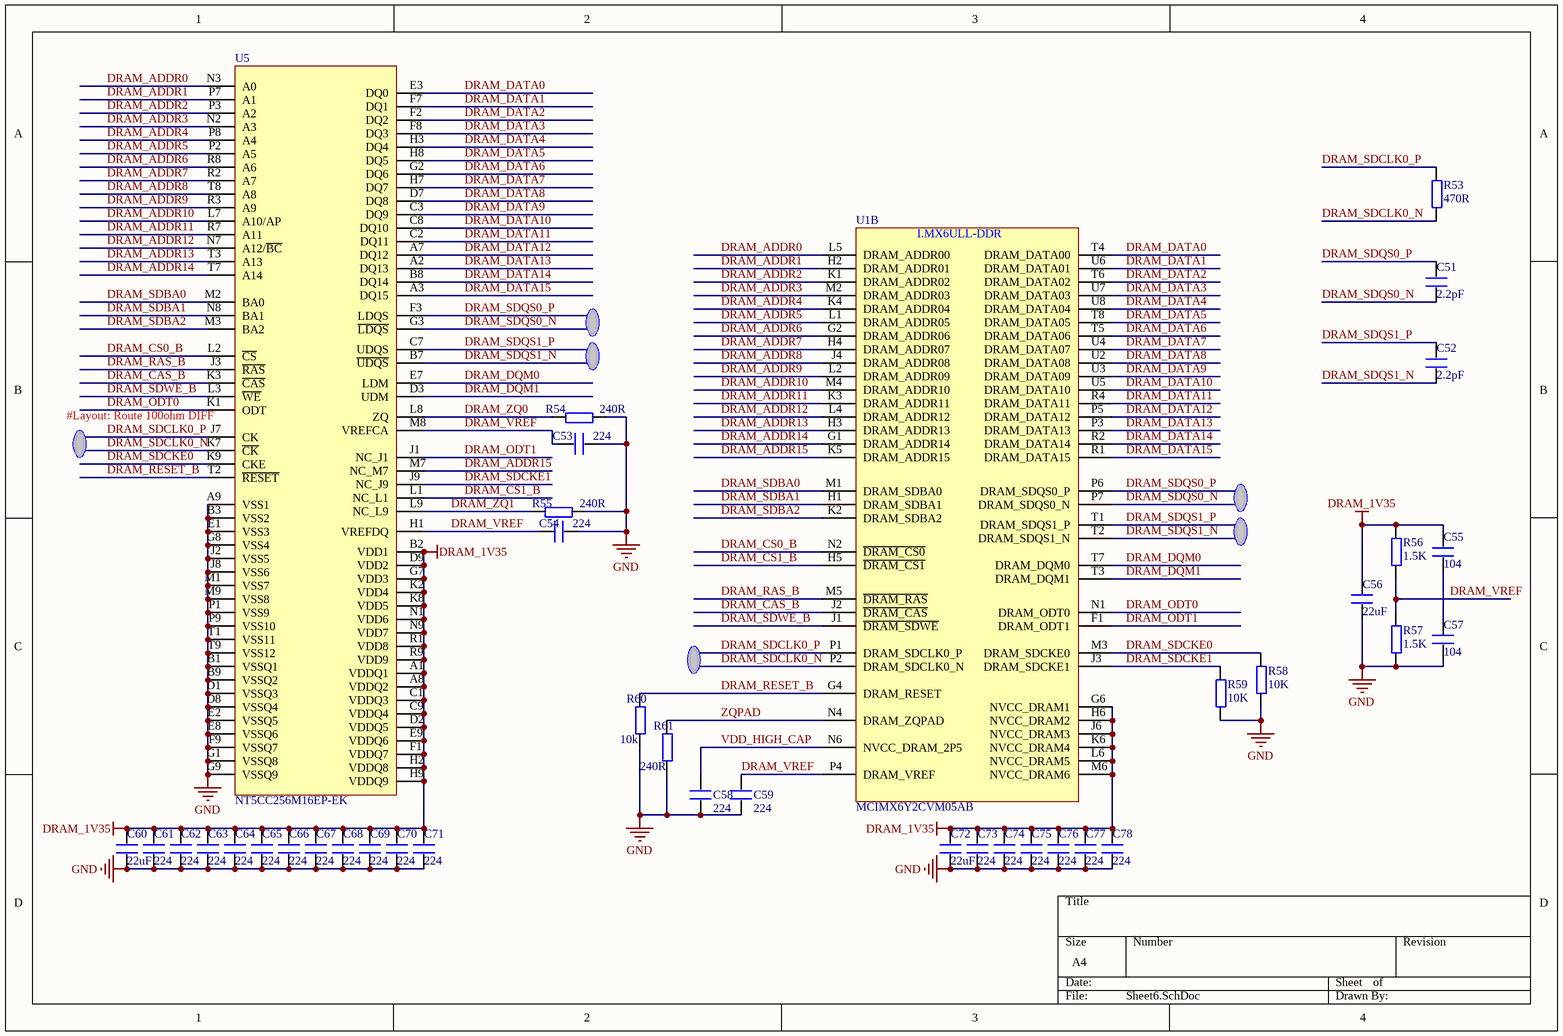
[diagram p5: Sheet6.SchDoc]

### Parts
C51  2.2pF  [C 0402]
C52  2.2pF  [C 0402]
C53  224  [C 0402]
C54  224  [C 0402]
C55  104  [C 0402]
C56  22uF  [C 0402]
C57  104  [C 0402]
C58  224  [C 0402]
C59  224  [C 0402]
C60  22uF  [C 0402]
C61  224  [C 0402]
C62  224  [C 0402]
C63  224  [C 0402]
C64  224  [C 0402]
C65  224  [C 0402]
C66  224  [C 0402]
C67  224  [C 0402]
C68  224  [C 0402]
C69  224  [C 0402]
C70  224  [C 0402]
C71  224  [C 0402]
C72  22uF  [C 0402]
C73  224  [C 0402]
C74  224  [C 0402]
C75  224  [C 0402]
C76  224  [C 0402]
C77  224  [C 0402]
C78  224  [C 0402]
R53  470R  [R 0402]
R54  240R  [R 0402]
R55  240R  [R 0402]
R56  1.5K  [R 0402]
R57  1.5K  [R 0402]
R58  10K  [R 0402]
R59  10K  [R 0402]
R60  10k  [R 0402]
R61  240R  [R 0402]
U1  MCIMX6Y2CVM05AB  [BGA289C80P17X17_1400X1400X132]  (part B of 5)
U5  NT5CC256M16EP-EK  [BGA96]

### Nets
DRAM_1V35: C55.2 C56.2 C60.2 C61.2 C62.2 C63.2 C64.2 C65.2 C66.2 C67.2 C68.2 C69.2 C70.2 C71.2 C72.2 C73.2 C74.2 C75.2 C76.2 C77.2 C78.2 R56.2 U1.G6(NVCC_DRAM1) U1.H6(NVCC_DRAM2) U1.J6(NVCC_DRAM3) U1.K6(NVCC_DRAM4) U1.L6(NVCC_DRAM5) U1.M6(NVCC_DRAM6) U5.A1(VDDQ1) U5.A8(VDDQ2) U5.B2(VDD1) U5.C1(VDDQ3) U5.C9(VDDQ4) U5.D2(VDDQ5) U5.D9(VDD2) U5.E9(VDDQ6) U5.F1(VDDQ7) U5.G7(VDD3) U5.H2(VDDQ8) U5.H9(VDDQ9) U5.K2(VDD4) U5.K8(VDD5) U5.N1(VDD6) U5.N9(VDD7) U5.R1(VDD8) U5.R9(VDD9)
GND: C53.2 C54.2 C56.1 C57.1 C58.1 C59.1 C60.1 C61.1 C62.1 C63.1 C64.1 C65.1 C66.1 C67.1 C68.1 C69.1 C70.1 C71.1 C72.1 C73.1 C74.1 C75.1 C76.1 C77.1 C78.1 R54.2 R55.2 R57.1 R58.1 R59.1 R60.1 R61.1 U5.A9(VSS1) U5.B1(VSSQ1) U5.B3(VSS2) U5.B9(VSSQ2) U5.D1(VSSQ3) U5.D8(VSSQ4) U5.E1(VSS3) U5.E2(VSSQ5) U5.E8(VSSQ6) U5.F9(VSSQ7) U5.G1(VSSQ8) U5.G8(VSS4) U5.G9(VSSQ9) U5.J2(VSS5) U5.J8(VSS6) U5.M1(VSS7) U5.M9(VSS8) U5.P1(VSS9) U5.P9(VSS10) U5.T1(VSS11) U5.T9(VSS12)
DRAM_ADDR0: U1.L5(DRAM_ADDR00) U5.N3(A0)
DRAM_ADDR1: U1.H2(DRAM_ADDR01) U5.P7(A1)
DRAM_ADDR2: U1.K1(DRAM_ADDR02) U5.P3(A2)
DRAM_ADDR3: U1.M2(DRAM_ADDR03) U5.N2(A3)
DRAM_ADDR4: U1.K4(DRAM_ADDR04) U5.P8(A4)
DRAM_ADDR5: U1.L1(DRAM_ADDR05) U5.P2(A5)
DRAM_ADDR6: U1.G2(DRAM_ADDR06) U5.R8(A6)
DRAM_ADDR7: U1.H4(DRAM_ADDR07) U5.R2(A7)
DRAM_ADDR8: U1.J4(DRAM_ADDR08) U5.T8(A8)
DRAM_ADDR9: U1.L2(DRAM_ADDR09) U5.R3(A9)
DRAM_ADDR10: U1.M4(DRAM_ADDR10) U5.L7(A10/AP)
DRAM_ADDR11: U1.K3(DRAM_ADDR11) U5.R7(A11)
DRAM_ADDR12: U1.L4(DRAM_ADDR12) U5.N7(A12/~{BC})
DRAM_ADDR13: U1.H3(DRAM_ADDR13) U5.T3(A13)
DRAM_ADDR14: U1.G1(DRAM_ADDR14) U5.T7(A14)
DRAM_ADDR15: U1.K5(DRAM_ADDR15) U5.M7(NC_M7)
DRAM_CAS_B: U1.J2(~{DRAM_CAS}) U5.K3(~{CAS})
DRAM_CS0_B: U1.N2(~{DRAM_CS0}) U5.L2(~{CS})
DRAM_CS1_B: U1.H5(~{DRAM_CS1}) U5.L1(NC_L1)
DRAM_DATA0: U1.T4(DRAM_DATA00) U5.E3(DQ0)
DRAM_DATA1: U1.U6(DRAM_DATA01) U5.F7(DQ1)
DRAM_DATA2: U1.T6(DRAM_DATA02) U5.F2(DQ2)
DRAM_DATA3: U1.U7(DRAM_DATA03) U5.F8(DQ3)
DRAM_DATA4: U1.U8(DRAM_DATA04) U5.H3(DQ4)
DRAM_DATA5: U1.T8(DRAM_DATA05) U5.H8(DQ5)
DRAM_DATA6: U1.T5(DRAM_DATA06) U5.G2(DQ6)
DRAM_DATA7: U1.U4(DRAM_DATA07) U5.H7(DQ7)
DRAM_DATA8: U1.U2(DRAM_DATA08) U5.D7(DQ8)
DRAM_DATA9: U1.U3(DRAM_DATA09) U5.C3(DQ9)
DRAM_DATA10: U1.U5(DRAM_DATA10) U5.C8(DQ10)
DRAM_DATA11: U1.R4(DRAM_DATA11) U5.C2(DQ11)
DRAM_DATA12: U1.P5(DRAM_DATA12) U5.A7(DQ12)
DRAM_DATA13: U1.P3(DRAM_DATA13) U5.A2(DQ13)
DRAM_DATA14: U1.R2(DRAM_DATA14) U5.B8(DQ14)
DRAM_DATA15: U1.R1(DRAM_DATA15) U5.A3(DQ15)
DRAM_DQM0: U1.T7(DRAM_DQM0) U5.E7(LDM)
DRAM_DQM1: U1.T3(DRAM_DQM1) U5.D3(UDM)
DRAM_ODT0: U1.N1(DRAM_ODT0) U5.K1(ODT)
DRAM_ODT1: U1.F1(DRAM_ODT1) U5.J1(NC_J1)
DRAM_RAS_B: U1.M5(~{DRAM_RAS}) U5.J3(~{RAS})
DRAM_RESET_B: R60.2 U1.G4(DRAM_RESET) U5.T2(~{RESET})
DRAM_SDBA0: U1.M1(DRAM_SDBA0) U5.M2(BA0)
DRAM_SDBA1: U1.H1(DRAM_SDBA1) U5.N8(BA1)
DRAM_SDBA2: U1.K2(DRAM_SDBA2) U5.M3(BA2)
DRAM_SDCKE0: R58.2 U1.M3(DRAM_SDCKE0) U5.K9(CKE)
DRAM_SDCKE1: R59.2 U1.J3(DRAM_SDCKE1) U5.J9(NC_J9)
DRAM_SDCLK0_N: R53.1 U1.P2(DRAM_SDCLK0_N) U5.K7(~{CK})
DRAM_SDCLK0_P: R53.2 U1.P1(DRAM_SDCLK0_P) U5.J7(CK)
DRAM_SDQS0_N: C51.1 U1.P7(DRAM_SDQS0_N) U5.G3(~{LDQS})
DRAM_SDQS0_P: C51.2 U1.P6(DRAM_SDQS0_P) U5.F3(LDQS)
DRAM_SDQS1_N: C52.1 U1.T2(DRAM_SDQS1_N) U5.B7(~{UDQS})
DRAM_SDQS1_P: C52.2 U1.T1(DRAM_SDQS1_P) U5.C7(UDQS)
DRAM_SDWE_B: U1.J1(~{DRAM_SDWE}) U5.L3(~{WE})
DRAM_VREF: C53.1 C54.1 C59.2 R56.1 R57.2 U1.P4(DRAM_VREF) U5.H1(VREFDQ) U5.M8(VREFCA)
DRAM_ZQ0: R54.1 U5.L8(ZQ)
DRAM_ZQ1: R55.1 U5.L9(NC_L9)
VDD_HIGH_CAP: C58.2 U1.N6(NVCC_DRAM_2P5)
ZQPAD: R61.2 U1.N4(DRAM_ZQPAD)
NetC55_1: C55.1 C57.2

### Notes on the sheet
- (near U5) #Layout: Route 100ohm DIFF
- (in symbol MCIMX6Y2CVM05AB, part B) I.MX6ULL-DDR

### Library data of the parts
C51-C78 = C
R53-R61 = R
U5 = MT41K256M16TW

## Sheet Sheet7.SchDoc
size A4
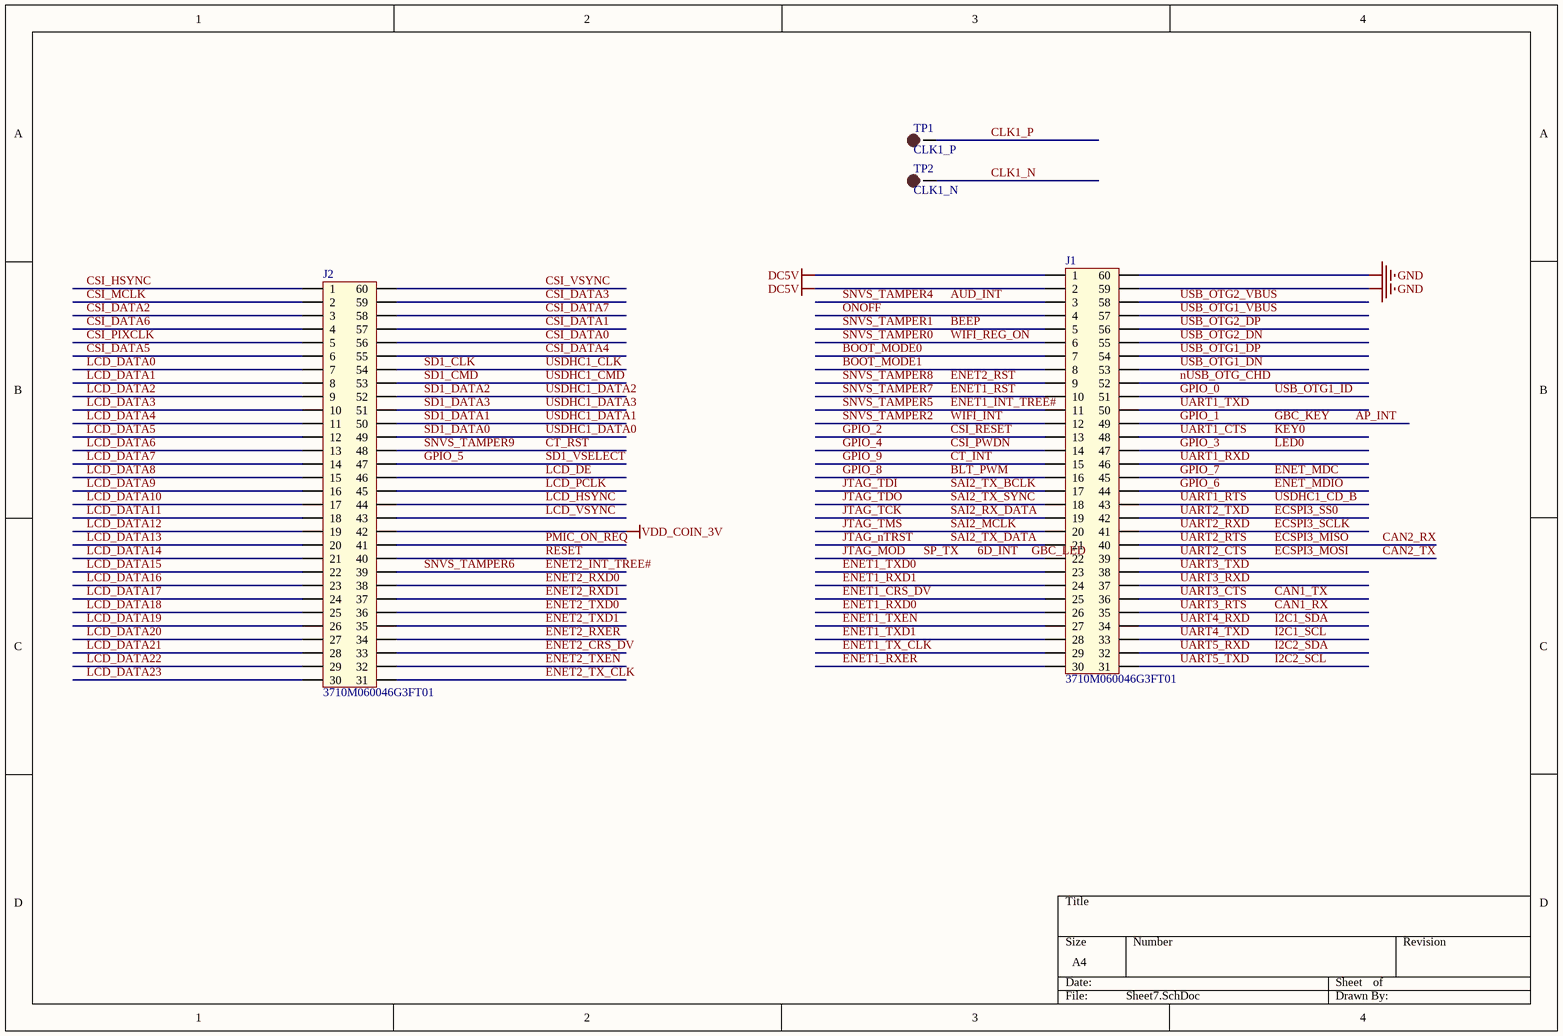
[diagram p6: Sheet7.SchDoc]

### Parts
J1  3710M060046G3FT01  [3710F060046G3FT01]
J2  3710M060046G3FT01  [3710F060046G3FT01]
TP1  CLK1_P  [TP-1.0]
TP2  CLK1_N  [TP-1.0]

### Nets
DC5V: J1.1 J1.2
GND: J1.59 J1.60
USB_OTG1_VBUS: J1.57
USB_OTG2_VBUS: J1.58
VDD_COIN_3V: J2.42
6D_INT: J1.22  [also labelled GBC_LED, JTAG_MOD, SP_TX]
AP_INT: J1.49  [also labelled GBC_KEY, GPIO_1]
AUD_INT: J1.3  [also labelled SNVS_TAMPER4]
BEEP: J1.5  [also labelled SNVS_TAMPER1]
BLT_PWM: J1.16  [also labelled GPIO_8]
BOOT_MODE0: J1.7
BOOT_MODE1: J1.8
CAN1_RX: J1.35  [also labelled UART3_RTS]
CAN1_TX: J1.36  [also labelled UART3_CTS]
CAN2_RX: J1.40  [also labelled ECSPI3_MISO, UART2_RTS]
CAN2_TX: J1.39  [also labelled ECSPI3_MOSI, UART2_CTS]
CLK1_N: TP2.1
CLK1_P: TP1.1
CSI_DATA0: J2.56
CSI_DATA1: J2.57
CSI_DATA2: J2.3
CSI_DATA3: J2.59
CSI_DATA4: J2.55
CSI_DATA5: J2.6
CSI_DATA6: J2.4
CSI_DATA7: J2.58
CSI_HSYNC: J2.1
CSI_MCLK: J2.2
CSI_PIXCLK: J2.5
CSI_PWDN: J1.14  [also labelled GPIO_4]
CSI_RESET: J1.13  [also labelled GPIO_2]
CSI_VSYNC: J2.60
CT_INT: J1.15  [also labelled GPIO_9]
CT_RST: J2.48  [also labelled SNVS_TAMPER9]
ECSPI3_SCLK: J1.41  [also labelled UART2_RXD]
ECSPI3_SS0: J1.42  [also labelled UART2_TXD]
ENET1_CRS_DV: J1.25
ENET1_INT_TREE#: J1.11  [also labelled SNVS_TAMPER5]
ENET1_RST: J1.10  [also labelled SNVS_TAMPER7]
ENET1_RXD0: J1.26
ENET1_RXD1: J1.24
ENET1_RXER: J1.30
ENET1_TX_CLK: J1.29
ENET1_TXD0: J1.23
ENET1_TXD1: J1.28
ENET1_TXEN: J1.27
ENET2_CRS_DV: J2.33
ENET2_INT_TREE#: J2.39  [also labelled SNVS_TAMPER6]
ENET2_RST: J1.9  [also labelled SNVS_TAMPER8]
ENET2_RXD0: J2.38
ENET2_RXD1: J2.37
ENET2_RXER: J2.34  [project net ECSPI4_SS0]
ENET2_TX_CLK: J2.31  [project net ECSPI4_MISO]
ENET2_TXD0: J2.36
ENET2_TXD1: J2.35  [project net ECSPI4_SCLK]
ENET2_TXEN: J2.32  [project net ECSPI4_MOSI]
ENET_MDC: J1.45  [also labelled GPIO_7]
ENET_MDIO: J1.44  [also labelled GPIO_6]
GPIO_0: J1.51  [also labelled USB_OTG1_ID]
GPIO_3: J1.47  [also labelled LED0]
GPIO_5: J2.47  [also labelled SD1_VSELECT]
I2C1_SCL: J1.33  [also labelled UART4_TXD]
I2C1_SDA: J1.34  [also labelled UART4_RXD]
I2C2_SCL: J1.31  [also labelled UART5_TXD]
I2C2_SDA: J1.32  [also labelled UART5_RXD]
JTAG_nTRST: J1.21  [also labelled SAI2_TX_DATA]
JTAG_TCK: J1.19  [also labelled SAI2_RX_DATA]
JTAG_TDI: J1.17  [also labelled SAI2_TX_BCLK]
JTAG_TDO: J1.18  [also labelled SAI2_TX_SYNC]
JTAG_TMS: J1.20  [also labelled SAI2_MCLK]
KEY0: J1.48  [also labelled UART1_CTS]  [project net HDMI_INT]
LCD_DATA0: J2.7
LCD_DATA1: J2.8
LCD_DATA2: J2.9
LCD_DATA3: J2.10
LCD_DATA4: J2.11
LCD_DATA5: J2.12
LCD_DATA6: J2.13
LCD_DATA7: J2.14
LCD_DATA8: J2.15
LCD_DATA9: J2.16
LCD_DATA10: J2.17
LCD_DATA11: J2.18
LCD_DATA12: J2.19
LCD_DATA13: J2.20
LCD_DATA14: J2.21
LCD_DATA15: J2.22
LCD_DATA16: J2.23
LCD_DATA17: J2.24
LCD_DATA18: J2.25
LCD_DATA19: J2.26
LCD_DATA20: J2.27
LCD_DATA21: J2.28
LCD_DATA22: J2.29
LCD_DATA23: J2.30
LCD_DE: J2.46
LCD_HSYNC: J2.44
LCD_PCLK: J2.45
LCD_VSYNC: J2.43
nUSB_OTG_CHD: J1.52
ONOFF: J1.4
PMIC_ON_REQ: J2.41
RESET: J2.40
SD1_CLK: J2.54  [also labelled USDHC1_CLK]
SD1_CMD: J2.53  [also labelled USDHC1_CMD]
SD1_DATA0: J2.49  [also labelled USDHC1_DATA0]
SD1_DATA1: J2.50  [also labelled USDHC1_DATA1]
SD1_DATA2: J2.52  [also labelled USDHC1_DATA2]
SD1_DATA3: J2.51  [also labelled USDHC1_DATA3]
SNVS_TAMPER0: J1.6  [also labelled WIFI_REG_ON]  [project net ACC_INT]
SNVS_TAMPER2: J1.12  [also labelled WIFI_INT]  [project net PERI_PWREN]
UART1_RTS: J1.43  [also labelled USDHC1_CD_B]  [project net SD1_CD]
UART1_RXD: J1.46
UART1_TXD: J1.50
UART3_RXD: J1.37  [project net UART2_RTS_BB]
UART3_TXD: J1.38  [project net UART2_CTS_BB]
USB_OTG1_DN: J1.53
USB_OTG1_DP: J1.54
USB_OTG2_DN: J1.55
USB_OTG2_DP: J1.56

### Library data of the parts
J1 J2 = 3710F: 3710F060046G3FT01
TP1 TP2 = TEST-POINT: 测试点

## Sheet Sheet8.SchDoc
size A4
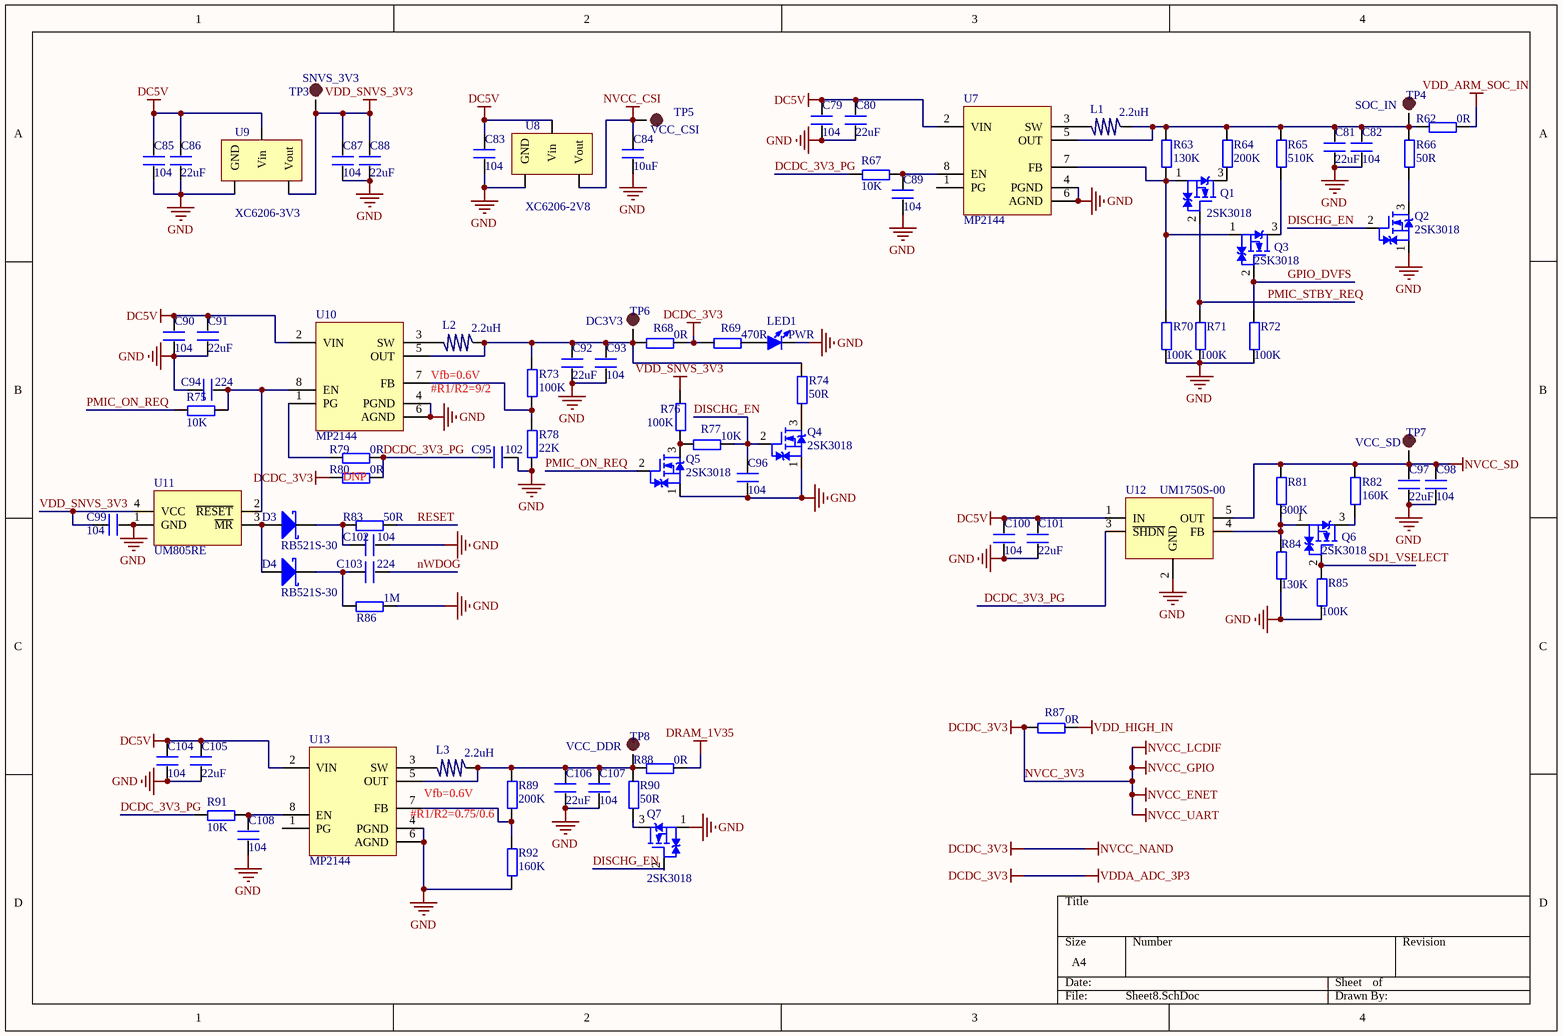
[diagram p7: Sheet8.SchDoc]

### Parts
C79  104  [C 0402]
C80  22uF  [C 0402]
C81  22uF  [C 0402]
C82  104  [C 0402]
C83  104  [C 0402]
C84  10uF  [C 0402]
C85  104  [C 0402]
C86  22uF  [C 0402]
C87  104  [C 0402]
C88  22uF  [C 0402]
C89  104  [C 0402]
C90  104  [C 0402]
C91  22uF  [C 0402]
C92  22uF  [C 0402]
C93  104  [C 0402]
C94  224  [C 0402]
C95  102  [C 0402]
C96  104  [C 0402]
C97  22uF  [C 0402]
C98  104  [C 0402]
C99  104  [C 0402]
C100  104  [C 0402]
C101  22uF  [C 0402]
C102  104  [C 0402]
C103  224  [C 0402]
C104  104  [C 0402]
C105  22uF  [C 0402]
C106  22uF  [C 0402]
C107  104  [C 0402]
C108  104  [C 0402]
D3  RB521S-30  [SOD-523]
D4  RB521S-30  [SOD-523]
L1  2.2uH  [NR3015]
L2  2.2uH  [NR3015]
L3  2.2uH  [NR3015]
LED1  PWR  [LED 0603B]
Q1  2SK3018  [SC70-3L]
Q2  2SK3018  [SC70-3L]
Q3  2SK3018  [SC70-3L]
Q4  2SK3018  [SC70-3L]
Q5  2SK3018  [SC70-3L]
Q6  2SK3018  [SC70-3L]
Q7  2SK3018  [SC70-3L]
R62  0R  [R 0402]
R63  130K  [R 0402]
R64  200K  [R 0402]
R65  510K  [R 0402]
R66  50R  [R 0402]
R67  10K  [R 0402]
R68  0R  [R 0402]
R69  470R  [R 0402]
R70  100K  [R 0402]
R71  100K  [R 0402]
R72  100K  [R 0402]
R73  100K  [R 0402]
R74  50R  [R 0402]
R75  10K  [R 0402]
R76  100K  [R 0402]
R77  10K  [R 0402]
R78  22K  [R 0402]
R79  0R  [R 0402]
R80  0R  [R 0402]
R81  300K  [R 0402]
R82  160K  [R 0402]
R83  50R  [R 0402]
R84  130K  [R 0402]
R85  100K  [R 0402]
R86  1M  [R 0402]
R87  0R  [R 0402]
R88  0R  [R 0402]
R89  200K  [R 0402]
R90  50R  [R 0402]
R91  10K  [R 0402]
R92  160K  [R 0402]
TP3  SNVS_3V3  [TP-1.0]
TP4  SOC_IN  [TP-1.0]
TP5  VCC_CSI  [TP-1.0]
TP6  DC3V3  [TP-1.0]
TP7  VCC_SD  [TP-1.0]
TP8  VCC_DDR  [TP-1.0]
U7  MP2144  [SOT23-8L]
U8  XC6206-2V8  [SOT23-3L]
U9  XC6206-3V3  [SOT23-3L]
U10  MP2144  [SOT23-8L]
U11  UM805RE  [SOT143]
U12  UM1750S-00  [SOT23-5L]
U13  MP2144  [SOT23-8L]

### Nets
DC5V: C79.2 C80.2 C83.2 C85.2 C86.2 C90.2 C91.2 C100.2 C101.2 C104.2 C105.2 U7.2(VIN) U8.2(Vin) U9.2(Vin) U10.2(VIN) U12.1(IN) U13.2(VIN)
DRAM_1V35: R88.2
GND: C79.1 C80.1 C81.1 C82.1 C83.1 C84.1 C85.1 C86.1 C87.1 C88.1 C89.1 C90.1 C91.1 C92.2 C93.2 C94.2 C95.1 C96.2 C97.1 C98.1 C99.1 C100.1 C101.1 C102.1 C104.1 C105.1 C106.2 C107.2 C108.1 LED1.2(K) Q2.1(S) Q4.1(S) Q5.1(S) Q7.1(S) R70.1 R71.1 R72.1 R78.1 R84.1 R85.1 R86.2 R92.1 U7.4(PGND) U7.6(AGND) U8.0(GND) U9.0(GND) U10.4(PGND) U10.6(AGND) U11.1(GND) U12.2(GND) U13.4(PGND) U13.6(AGND)
NVCC_3V3: R68.2 R69.1 R80.1 R87.1  [also labelled DCDC_3V3, NVCC_ENET, NVCC_GPIO, NVCC_LCDIF, NVCC_NAND, NVCC_UART, VDDA_ADC_3P3]
NVCC_CSI: C84.2 TP5.1 U8.1(Vout)
NVCC_SD: C97.2 C98.2 R81.2 R82.2 TP7.1 U12.5(OUT)
VDD_ARM_SOC_IN: R62.2
VDD_HIGH_IN: R87.2
VDD_SNVS_3V3: C87.2 C88.2 C99.2 R76.2 TP3.1 U9.1(Vout) U11.4(VCC)
DCDC_3V3_PG: C95.2 R67.1 R79.2 R80.2 R91.1 U12.3(~{SHDN})
DISCHG_EN: C96.1 Q2.2(G) Q4.2(G) Q7.2(G) R77.2
GPIO_DVFS: Q3.2(G) R72.2
nWDOG: C103.1
PMIC_ON_REQ: Q5.2(G) R75.1
PMIC_STBY_REQ: Q1.2(G) R71.2
RESET: R83.2
SD1_VSELECT: Q6.2(G) R85.2  [project net GPIO_5]
NetC81_2: C81.2 C82.2 L1.1 R62.1 R63.2 R64.2 R65.2 R66.2 TP4.1 U7.5(OUT)
NetC89_2: C89.2 R67.2 U7.8(EN)
NetC92_1: C92.1 C93.1 L2.1 R68.1 R73.2 R74.2 TP6.1 U10.5(OUT)
NetC94_1: C94.1 R75.2 U10.8(EN) U11.2(~{RESET})
NetC102_2: C102.2 D3.2(C) R83.1
NetC103_2: C103.2 D4.2(C) R86.1
NetC106_1: C106.1 C107.1 L3.1 R88.1 R89.2 R90.2 TP8.1 U13.5(OUT)
NetC108_2: C108.2 R91.2 U13.8(EN)
NetD3_1: D3.1(A) D4.1(A) U11.3(~{MR})
NetL1_2: L1.2 U7.3(SW)
NetL2_2: L2.2 U10.3(SW)
NetL3_2: L3.2 U13.3(SW)
NetLED1_1: LED1.1(A) R69.2
NetQ1_1: Q1.1(S) Q3.1(S) R63.1 R70.2 U7.7(FB)
NetQ1_3: Q1.3(D) R64.1
NetQ2_3: Q2.3(D) R66.1
NetQ3_3: Q3.3(D) R65.1
NetQ4_3: Q4.3(D) R74.1
NetQ5_3: Q5.3(D) R76.1 R77.1
NetQ6_1: Q6.1(S) R81.1 R84.2 U12.4(FB)
NetQ6_3: Q6.3(D) R82.1
NetQ7_3: Q7.3(D) R90.1
NetR73_1: R73.1 R78.2 U10.7(FB)
NetR79_1: R79.1 U10.1(PG)
NetR89_1: R89.1 R92.2 U13.7(FB)

Not connected (* = marked no-connect by the designer): U7 1(PG); U13 1(PG)

### Notes on the sheet
- Vfb=0.6V
- #R1/R2=9/2
- (near R80) DNP
- #R1/R2=0.75/0.6

### Library data of the parts
C79-C108 = C
L1-L3 = L
LED1 = LED-SMD: 贴片LED; 版权归属: 源创客; BOM名称: 贴片LED; 学习资源: www.ooocke.com
Q1-Q7 = 2SK3018: N沟场效应管  30V,0.1A; 版权归属: 源创客; BOM名称: N沟场效应管; 学习资源: www.ooocke.com
R62-R92 = R
TP3-TP8 = TEST-POINT: 测试点
U8 = XC6206-3V3

## Nets that join several sheets
DC5V: Sheet7 (J1.1 J1.2), Sheet8 (17 pins)
DRAM_1V35: Sheet6 (46 pins), Sheet8 (R88.2)
GND: Sheet1 (24 pins), Sheet2 (20 pins), Sheet3 (66 pins), Sheet4 (29 pins), Sheet5 (C48.2 C49.2 C50.1), Sheet6 (53 pins), Sheet7 (J1.59 J1.60), Sheet8 (52 pins)
NVCC_3V3: Sheet1 (R1.1 R2.1 R3.1 R4.1), Sheet2 (6 pins), Sheet4 (31 pins), Sheet5 (6 pins), Sheet8 (R68.2 R69.1 R80.1 R87.1)
NVCC_CSI: Sheet4 (C43.1 U1.F4), Sheet8 (C84.2 TP5.1 U8.1)
NVCC_SD: Sheet2 (C8.2 R33.1 R34.1 U1.C4), Sheet8 (6 pins)
USB_OTG1_VBUS: Sheet2 (C4.2 U1.T12), Sheet7 (J1.57)
USB_OTG2_VBUS: Sheet2 (C7.2 U1.U12), Sheet7 (J1.58)
VDD_ARM_SOC_IN: Sheet3 (9 pins), Sheet8 (R62.2)
VDD_COIN_3V: Sheet3 (D2.1 R38.1), Sheet7 (J2.42)
VDD_HIGH_IN: Sheet3 (C25.2 C26.2 U1.N13), Sheet8 (R87.2)
VDD_SNVS_3V3: Sheet3 (D1.1), Sheet8 (7 pins)
VDD_SNVS_IN: Sheet2 (R30.1), Sheet3 (5 pins)
6D_INT: Sheet2 (R31.1 U1.P15), Sheet7 (J1.22)
ACC_INT: Sheet2 (U1.R10), Sheet7 (J1.6)
AP_INT: Sheet5 (U1.L15), Sheet7 (J1.49)
AUD_INT: Sheet2 (U1.P9), Sheet7 (J1.3)
BEEP: Sheet2 (U1.R9), Sheet7 (J1.5)
BLT_PWM: Sheet5 (U1.N17), Sheet7 (J1.16)
BOOT_MODE0: Sheet2 (U1.T10), Sheet7 (J1.7)
BOOT_MODE1: Sheet2 (U1.U10), Sheet7 (J1.8)
CAN1_RX: Sheet2 (U1.G14), Sheet7 (J1.35)
CAN1_TX: Sheet2 (U1.H15), Sheet7 (J1.36)
CAN2_RX: Sheet2 (U1.H14), Sheet7 (J1.40)
CAN2_TX: Sheet2 (U1.J15), Sheet7 (J1.39)
CLK1_N: Sheet2 (U1.P16), Sheet7 (TP2.1)
CLK1_P: Sheet2 (U1.P17), Sheet7 (TP1.1)
CSI_DATA0: Sheet4 (U1.E4), Sheet7 (J2.56)
CSI_DATA1: Sheet4 (U1.E3), Sheet7 (J2.57)
CSI_DATA2: Sheet4 (U1.E2), Sheet7 (J2.3)
CSI_DATA3: Sheet4 (U1.E1), Sheet7 (J2.59)
CSI_DATA4: Sheet4 (U1.D4), Sheet7 (J2.55)
CSI_DATA5: Sheet4 (U1.D3), Sheet7 (J2.6)
CSI_DATA6: Sheet4 (U1.D2), Sheet7 (J2.4)
CSI_DATA7: Sheet4 (U1.D1), Sheet7 (J2.58)
CSI_HSYNC: Sheet4 (U1.F3), Sheet7 (J2.1)
CSI_MCLK: Sheet4 (U1.F5), Sheet7 (J2.2)
CSI_PIXCLK: Sheet4 (U1.E5), Sheet7 (J2.5)
CSI_PWDN: Sheet5 (U1.M16), Sheet7 (J1.14)
CSI_RESET: Sheet5 (U1.L14), Sheet7 (J1.13)
CSI_VSYNC: Sheet4 (U1.F2), Sheet7 (J2.60)
CT_INT: Sheet5 (U1.M15), Sheet7 (J1.15)
CT_RST: Sheet2 (U1.R6), Sheet7 (J2.48)
ECSPI3_SCLK: Sheet2 (U1.J16), Sheet7 (J1.41)
ECSPI3_SS0: Sheet2 (U1.J17), Sheet7 (J1.42)
ECSPI4_MISO: Sheet5 (R52.2), Sheet7 (J2.31)
ECSPI4_MOSI: Sheet5 (U1.B15), Sheet7 (J2.32)
ECSPI4_SCLK: Sheet5 (U1.A16), Sheet7 (J2.35)
ECSPI4_SS0: Sheet5 (U1.D16), Sheet7 (J2.34)
ENET1_CRS_DV: Sheet5 (U1.E16), Sheet7 (J1.25)
ENET1_INT_TREE#: Sheet2 (U1.N8), Sheet7 (J1.11)
ENET1_RST: Sheet2 (U1.N10), Sheet7 (J1.10)
ENET1_RXD0: Sheet5 (U1.F16), Sheet7 (J1.26)
ENET1_RXD1: Sheet5 (U1.E17), Sheet7 (J1.24)
ENET1_RXER: Sheet5 (U1.D15), Sheet7 (J1.30)
ENET1_TX_CLK: Sheet5 (R50.2), Sheet7 (J1.29)
ENET1_TXD0: Sheet5 (U1.E15), Sheet7 (J1.23)
ENET1_TXD1: Sheet5 (U1.E14), Sheet7 (J1.28)
ENET1_TXEN: Sheet5 (U1.F15), Sheet7 (J1.27)
ENET2_CRS_DV: Sheet5 (U1.B17), Sheet7 (J2.33)
ENET2_INT_TREE#: Sheet2 (U1.N11), Sheet7 (J2.39)
ENET2_RST: Sheet2 (U1.N9), Sheet7 (J1.9)
ENET2_RXD0: Sheet5 (U1.C17), Sheet7 (J2.38)
ENET2_RXD1: Sheet5 (U1.C16), Sheet7 (J2.37)
ENET2_TXD0: Sheet5 (U1.A15), Sheet7 (J2.36)
ENET_MDC: Sheet5 (U1.L16), Sheet7 (J1.45)
ENET_MDIO: Sheet5 (U1.K17), Sheet7 (J1.44)
GPIO_0: Sheet5 (U1.K13), Sheet7 (J1.51)
GPIO_3: Sheet5 (U1.L17), Sheet7 (J1.47)
GPIO_5: Sheet5 (U1.M17), Sheet7 (J2.47), Sheet8 (Q6.2 R85.2)
GPIO_DVFS: Sheet2 (U1.P10), Sheet8 (Q3.2 R72.2)
HDMI_INT: Sheet2 (U1.K15), Sheet7 (J1.48)
I2C1_SCL: Sheet2 (U1.G17), Sheet7 (J1.33)
I2C1_SDA: Sheet2 (U1.G16), Sheet7 (J1.34)
I2C2_SCL: Sheet2 (U1.F17), Sheet7 (J1.31)
I2C2_SDA: Sheet2 (U1.G13), Sheet7 (J1.32)
JTAG_nTRST: Sheet2 (U1.N14), Sheet7 (J1.21)
JTAG_TCK: Sheet2 (R29.1 U1.M14), Sheet7 (J1.19)
JTAG_TDI: Sheet2 (U1.N16), Sheet7 (J1.17)
JTAG_TDO: Sheet2 (U1.N15), Sheet7 (J1.18)
JTAG_TMS: Sheet2 (U1.P14), Sheet7 (J1.20)
LCD_DATA0: Sheet1 (R4.2 R5.2), Sheet5 (U1.B9), Sheet7 (J2.7)
LCD_DATA1: Sheet1 (R3.2 R6.2), Sheet5 (U1.A9), Sheet7 (J2.8)
LCD_DATA2: Sheet1 (R7.2), Sheet5 (U1.E10), Sheet7 (J2.9)
LCD_DATA3: Sheet1 (R8.2), Sheet5 (U1.D10), Sheet7 (J2.10)
LCD_DATA4: Sheet1 (R9.2), Sheet5 (U1.C10), Sheet7 (J2.11)
LCD_DATA5: Sheet1 (R10.2), Sheet5 (U1.B10), Sheet7 (J2.12)
LCD_DATA6: Sheet1 (R11.2), Sheet5 (U1.A10), Sheet7 (J2.13)
LCD_DATA7: Sheet1 (R12.2), Sheet5 (U1.D11), Sheet7 (J2.14)
LCD_DATA8: Sheet1 (R13.2), Sheet5 (U1.B11), Sheet7 (J2.15)
LCD_DATA9: Sheet1 (R14.2), Sheet5 (U1.A11), Sheet7 (J2.16)
LCD_DATA10: Sheet1 (R15.2), Sheet5 (U1.E12), Sheet7 (J2.17)
LCD_DATA11: Sheet1 (R16.2), Sheet5 (U1.D12), Sheet7 (J2.18)
LCD_DATA12: Sheet1 (R17.2), Sheet5 (U1.C12), Sheet7 (J2.19)
LCD_DATA13: Sheet1 (R2.2 R18.2), Sheet5 (U1.B12), Sheet7 (J2.20)
LCD_DATA14: Sheet1 (R1.2 R19.2), Sheet5 (U1.A12), Sheet7 (J2.21)
LCD_DATA15: Sheet1 (R20.2), Sheet5 (U1.D13), Sheet7 (J2.22)
LCD_DATA16: Sheet1 (R21.2), Sheet5 (U1.C13), Sheet7 (J2.23)
LCD_DATA17: Sheet1 (R22.2), Sheet5 (U1.B13), Sheet7 (J2.24)
LCD_DATA18: Sheet1 (R23.2), Sheet5 (U1.A13), Sheet7 (J2.25)
LCD_DATA19: Sheet1 (R24.2), Sheet5 (U1.D14), Sheet7 (J2.26)
LCD_DATA20: Sheet1 (R25.2), Sheet5 (U1.C14), Sheet7 (J2.27)
LCD_DATA21: Sheet1 (R26.2), Sheet5 (U1.B14), Sheet7 (J2.28)
LCD_DATA22: Sheet1 (R27.2), Sheet5 (U1.A14), Sheet7 (J2.29)
LCD_DATA23: Sheet1 (R28.2), Sheet5 (U1.B16), Sheet7 (J2.30)
LCD_DE: Sheet5 (U1.B8), Sheet7 (J2.46)
LCD_HSYNC: Sheet5 (U1.D9), Sheet7 (J2.44)
LCD_PCLK: Sheet5 (R49.1), Sheet7 (J2.45)
LCD_VSYNC: Sheet5 (U1.C9), Sheet7 (J2.43)
nUSB_OTG_CHD: Sheet2 (U1.U16), Sheet7 (J1.52)
nWDOG: Sheet5 (R51.1), Sheet8 (C103.1)
ONOFF: Sheet2 (U1.R8), Sheet7 (J1.4)
PERI_PWREN: Sheet2 (U1.P11), Sheet7 (J1.12)
PMIC_ON_REQ: Sheet2 (U1.T9), Sheet7 (J2.41), Sheet8 (Q5.2 R75.1)
PMIC_STBY_REQ: Sheet2 (U1.U9), Sheet8 (Q1.2 R71.2)
RESET: Sheet7 (J2.40), Sheet8 (R83.2)
SD1_CD: Sheet2 (U1.J14), Sheet7 (J1.43)
SD1_CLK: Sheet2 (C9.1 R32.1), Sheet7 (J2.54)
SD1_CMD: Sheet2 (R33.2 U1.C2), Sheet7 (J2.53)
SD1_DATA0: Sheet2 (R34.2 U1.B3), Sheet7 (J2.49)
SD1_DATA1: Sheet2 (U1.B2), Sheet7 (J2.50)
SD1_DATA2: Sheet2 (U1.B1), Sheet7 (J2.52)
SD1_DATA3: Sheet2 (U1.A2), Sheet7 (J2.51)
UART1_RXD: Sheet2 (U1.K16), Sheet7 (J1.46)
UART1_TXD: Sheet2 (U1.K14), Sheet7 (J1.50)
UART2_CTS_BB: Sheet2 (U1.H17), Sheet7 (J1.38)
UART2_RTS_BB: Sheet2 (U1.H16), Sheet7 (J1.37)
USB_OTG1_DN: Sheet2 (U1.T15), Sheet7 (J1.53)
USB_OTG1_DP: Sheet2 (U1.U15), Sheet7 (J1.54)
USB_OTG2_DN: Sheet2 (U1.T13), Sheet7 (J1.55)
USB_OTG2_DP: Sheet2 (U1.U13), Sheet7 (J1.56)
VDD_HIGH_CAP: Sheet3 (C27.2 C28.2 U1.R14 U1.R15), Sheet6 (C58.2 U1.N6)